# Altium project TEBF0808.PrjPCB (part 4 of 6)

## Sheet FMC.SchDoc: TEBF0808 - FMC
size A4; Organization: Trenz Electronic GmbH; DocumentNumber: TEBF0808; Revision: 04; SheetNumber: 18; SheetTotal: 36; Date: 2016-09-29; CompanyName: Trenz Electronic GmbH; ProjectName: TEB0808 - LAN9514
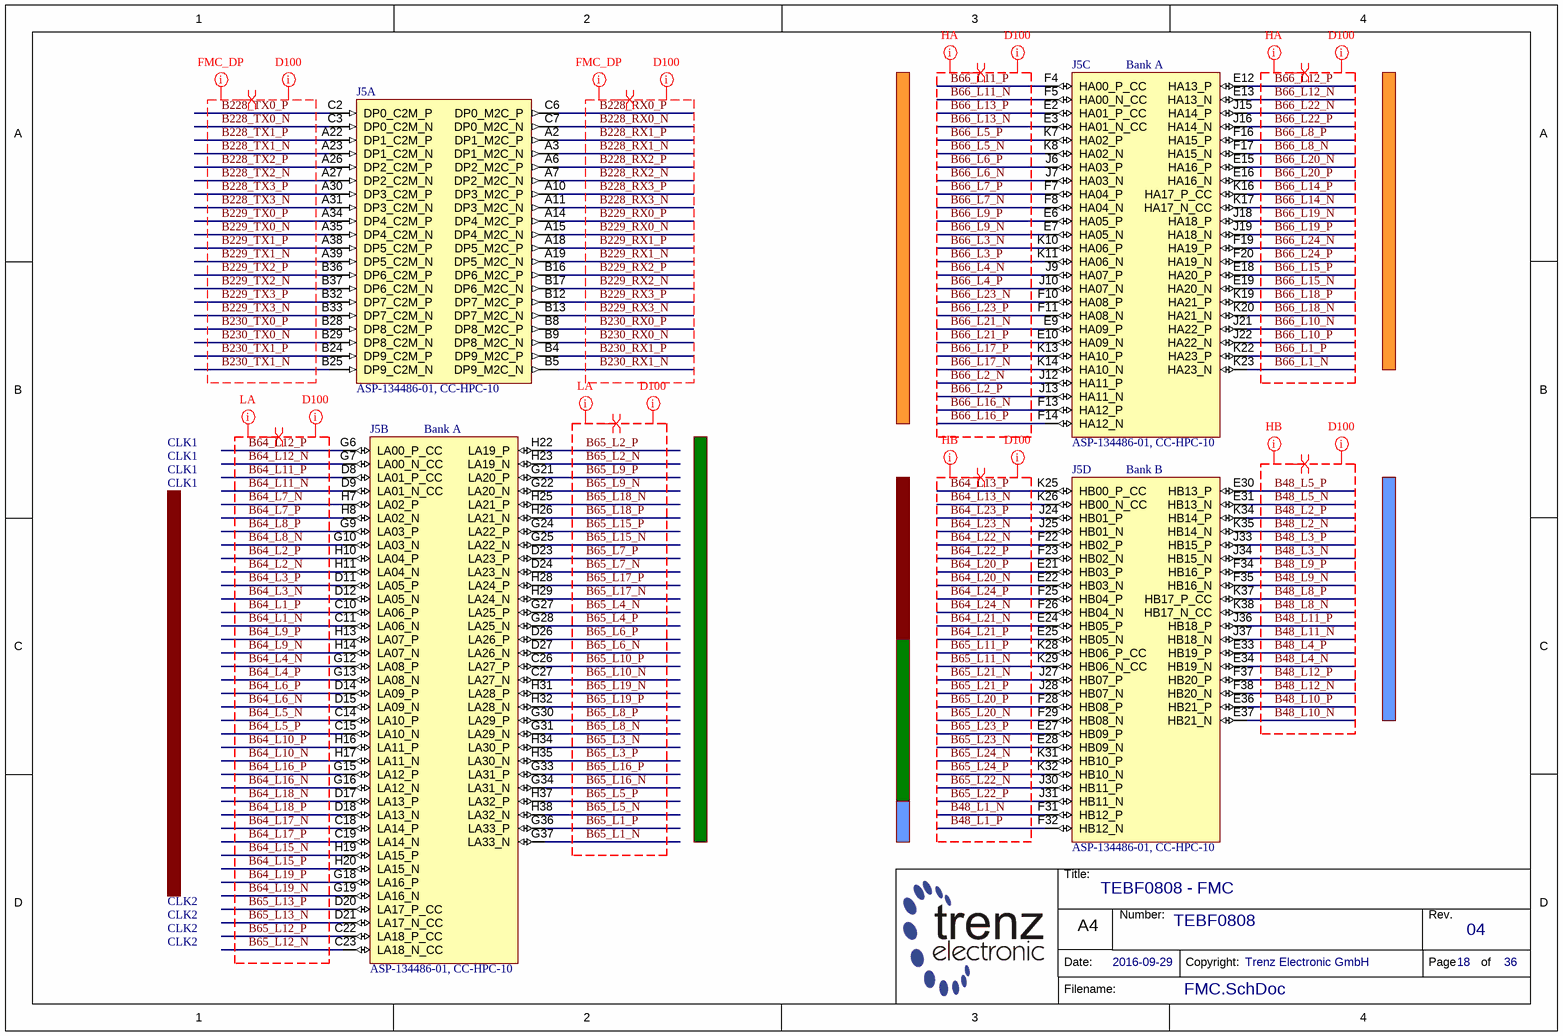
[diagram p22: FMC.SchDoc]

### Parts
J5  ASP-134486-01, CC-HPC-10  [ASP-134486-01B]  (parts A,B,C,D of 9)

### Nets
B48_L1_N: J5.F31(HB12_P)
B48_L1_P: J5.F32(HB12_N)
B48_L2_N: J5.K35(HB14_N)
B48_L2_P: J5.K34(HB14_P)
B48_L3_N: J5.J34(HB15_N)
B48_L3_P: J5.J33(HB15_P)
B48_L4_N: J5.E34(HB19_N)
B48_L4_P: J5.E33(HB19_P)
B48_L5_N: J5.E31(HB13_N)
B48_L5_P: J5.E30(HB13_P)
B48_L8_N: J5.K38(HB17_N_CC)
B48_L8_P: J5.K37(HB17_P_CC)
B48_L9_N: J5.F35(HB16_N)
B48_L9_P: J5.F34(HB16_P)
B48_L10_N: J5.E37(HB21_N)
B48_L10_P: J5.E36(HB21_P)
B48_L11_N: J5.J37(HB18_N)
B48_L11_P: J5.J36(HB18_P)
B48_L12_N: J5.F38(HB20_N)
B48_L12_P: J5.F37(HB20_P)
B64_L1_N: J5.C11(LA06_N)
B64_L1_P: J5.C10(LA06_P)
B64_L2_N: J5.H11(LA04_N)
B64_L2_P: J5.H10(LA04_P)
B64_L3_N: J5.D12(LA05_N)
B64_L3_P: J5.D11(LA05_P)
B64_L4_N: J5.G12(LA08_P)
B64_L4_P: J5.G13(LA08_N)
B64_L5_N: J5.C14(LA10_P)
B64_L5_P: J5.C15(LA10_N)
B64_L6_N: J5.D15(LA09_N)
B64_L6_P: J5.D14(LA09_P)
B64_L7_N: J5.H7(LA02_P)
B64_L7_P: J5.H8(LA02_N)
B64_L8_N: J5.G10(LA03_N)
B64_L8_P: J5.G9(LA03_P)
B64_L9_N: J5.H14(LA07_N)
B64_L9_P: J5.H13(LA07_P)
B64_L10_N: J5.H17(LA11_N)
B64_L10_P: J5.H16(LA11_P)
B64_L11_N: J5.D9(LA01_N_CC)
B64_L11_P: J5.D8(LA01_P_CC)
B64_L12_N: J5.G7(LA00_N_CC)
B64_L12_P: J5.G6(LA00_P_CC)
B64_L13_N: J5.K26(HB00_N_CC)
B64_L13_P: J5.K25(HB00_P_CC)
B64_L15_N: J5.H19(LA15_P)
B64_L15_P: J5.H20(LA15_N)
B64_L16_N: J5.G16(LA12_N)
B64_L16_P: J5.G15(LA12_P)
B64_L17_N: J5.C18(LA14_P)
B64_L17_P: J5.C19(LA14_N)
B64_L18_N: J5.D17(LA13_P)
B64_L18_P: J5.D18(LA13_N)
B64_L19_N: J5.G19(LA16_N)
B64_L19_P: J5.G18(LA16_P)
B64_L20_N: J5.E22(HB03_N)
B64_L20_P: J5.E21(HB03_P)
B64_L21_N: J5.E24(HB05_P)
B64_L21_P: J5.E25(HB05_N)
B64_L22_N: J5.F22(HB02_P)
B64_L22_P: J5.F23(HB02_N)
B64_L23_N: J5.J25(HB01_N)
B64_L23_P: J5.J24(HB01_P)
B64_L24_N: J5.F26(HB04_N)
B64_L24_P: J5.F25(HB04_P)
B65_L1_N: J5.G37(LA33_N)
B65_L1_P: J5.G36(LA33_P)
B65_L2_N: J5.H23(LA19_N)
B65_L2_P: J5.H22(LA19_P)
B65_L3_N: J5.H34(LA30_P)
B65_L3_P: J5.H35(LA30_N)
B65_L4_N: J5.G27(LA25_P)
B65_L4_P: J5.G28(LA25_N)
B65_L5_N: J5.H38(LA32_N)
B65_L5_P: J5.H37(LA32_P)
B65_L6_N: J5.D27(LA26_N)
B65_L6_P: J5.D26(LA26_P)
B65_L7_N: J5.D24(LA23_N)
B65_L7_P: J5.D23(LA23_P)
B65_L8_N: J5.G31(LA29_N)
B65_L8_P: J5.G30(LA29_P)
B65_L9_N: J5.G22(LA20_N)
B65_L9_P: J5.G21(LA20_P)
B65_L10_N: J5.C27(LA27_N)
B65_L10_P: J5.C26(LA27_P)
B65_L11_N: J5.K29(HB06_N_CC)
B65_L11_P: J5.K28(HB06_P_CC)
B65_L12_N: J5.C23(LA18_N_CC)
B65_L12_P: J5.C22(LA18_P_CC)
B65_L13_N: J5.D21(LA17_N_CC)
B65_L13_P: J5.D20(LA17_P_CC)
B65_L15_N: J5.G25(LA22_N)
B65_L15_P: J5.G24(LA22_P)
B65_L16_N: J5.G34(LA31_N)
B65_L16_P: J5.G33(LA31_P)
B65_L17_N: J5.H29(LA24_N)
B65_L17_P: J5.H28(LA24_P)
B65_L18_N: J5.H25(LA21_P)
B65_L18_P: J5.H26(LA21_N)
B65_L19_N: J5.H31(LA28_P)
B65_L19_P: J5.H32(LA28_N)
B65_L20_N: J5.F29(HB08_N)
B65_L20_P: J5.F28(HB08_P)
B65_L21_N: J5.J27(HB07_P)
B65_L21_P: J5.J28(HB07_N)
B65_L22_N: J5.J30(HB11_P)
B65_L22_P: J5.J31(HB11_N)
B65_L23_N: J5.E28(HB09_N)
B65_L23_P: J5.E27(HB09_P)
B65_L24_N: J5.K31(HB10_P)
B65_L24_P: J5.K32(HB10_N)
B66_L1_N: J5.K23(HA23_N)
B66_L1_P: J5.K22(HA23_P)
B66_L2_N: J5.J12(HA11_P)
B66_L2_P: J5.J13(HA11_N)
B66_L3_N: J5.K10(HA06_P)
B66_L3_P: J5.K11(HA06_N)
B66_L4_N: J5.J9(HA07_P)
B66_L4_P: J5.J10(HA07_N)
B66_L5_N: J5.K8(HA02_N)
B66_L5_P: J5.K7(HA02_P)
B66_L6_N: J5.J7(HA03_N)
B66_L6_P: J5.J6(HA03_P)
B66_L7_N: J5.F8(HA04_N)
B66_L7_P: J5.F7(HA04_P)
B66_L8_N: J5.F17(HA15_N)
B66_L8_P: J5.F16(HA15_P)
B66_L9_N: J5.E7(HA05_N)
B66_L9_P: J5.E6(HA05_P)
B66_L10_N: J5.J21(HA22_P)
B66_L10_P: J5.J22(HA22_N)
B66_L11_N: J5.F5(HA00_N_CC)
B66_L11_P: J5.F4(HA00_P_CC)
B66_L12_N: J5.E13(HA13_N)
B66_L12_P: J5.E12(HA13_P)
B66_L13_N: J5.E3(HA01_N_CC)
B66_L13_P: J5.E2(HA01_P_CC)
B66_L14_N: J5.K17(HA17_N_CC)
B66_L14_P: J5.K16(HA17_P_CC)
B66_L15_N: J5.E19(HA20_N)
B66_L15_P: J5.E18(HA20_P)
B66_L16_N: J5.F13(HA12_P)
B66_L16_P: J5.F14(HA12_N)
B66_L17_N: J5.K14(HA10_N)
B66_L17_P: J5.K13(HA10_P)
B66_L18_N: J5.K20(HA21_N)
B66_L18_P: J5.K19(HA21_P)
B66_L19_N: J5.J18(HA18_P)
B66_L19_P: J5.J19(HA18_N)
B66_L20_N: J5.E15(HA16_P)
B66_L20_P: J5.E16(HA16_N)
B66_L21_N: J5.E9(HA09_P)
B66_L21_P: J5.E10(HA09_N)
B66_L22_N: J5.J15(HA14_P)
B66_L22_P: J5.J16(HA14_N)
B66_L23_N: J5.F10(HA08_P)
B66_L23_P: J5.F11(HA08_N)
B66_L24_N: J5.F19(HA19_P)
B66_L24_P: J5.F20(HA19_N)
B228_RX0_N: J5.C7(DP0_M2C_N)
B228_RX0_P: J5.C6(DP0_M2C_P)
B228_RX1_N: J5.A3(DP1_M2C_N)
B228_RX1_P: J5.A2(DP1_M2C_P)
B228_RX2_N: J5.A7(DP2_M2C_N)
B228_RX2_P: J5.A6(DP2_M2C_P)
B228_RX3_N: J5.A11(DP3_M2C_N)
B228_RX3_P: J5.A10(DP3_M2C_P)
B228_TX0_N: J5.C3(DP0_C2M_N)
B228_TX0_P: J5.C2(DP0_C2M_P)
B228_TX1_N: J5.A23(DP1_C2M_N)
B228_TX1_P: J5.A22(DP1_C2M_P)
B228_TX2_N: J5.A27(DP2_C2M_N)
B228_TX2_P: J5.A26(DP2_C2M_P)
B228_TX3_N: J5.A31(DP3_C2M_N)
B228_TX3_P: J5.A30(DP3_C2M_P)
B229_RX0_N: J5.A15(DP4_M2C_N)
B229_RX0_P: J5.A14(DP4_M2C_P)
B229_RX1_N: J5.A19(DP5_M2C_N)
B229_RX1_P: J5.A18(DP5_M2C_P)
B229_RX2_N: J5.B17(DP6_M2C_N)
B229_RX2_P: J5.B16(DP6_M2C_P)
B229_RX3_N: J5.B13(DP7_M2C_N)
B229_RX3_P: J5.B12(DP7_M2C_P)
B229_TX0_N: J5.A35(DP4_C2M_N)
B229_TX0_P: J5.A34(DP4_C2M_P)
B229_TX1_N: J5.A39(DP5_C2M_N)
B229_TX1_P: J5.A38(DP5_C2M_P)
B229_TX2_N: J5.B37(DP6_C2M_N)
B229_TX2_P: J5.B36(DP6_C2M_P)
B229_TX3_N: J5.B33(DP7_C2M_N)
B229_TX3_P: J5.B32(DP7_C2M_P)
B230_RX0_N: J5.B9(DP8_M2C_N)
B230_RX0_P: J5.B8(DP8_M2C_P)
B230_RX1_N: J5.B5(DP9_M2C_N)
B230_RX1_P: J5.B4(DP9_M2C_P)
B230_TX0_N: J5.B29(DP8_C2M_N)
B230_TX0_P: J5.B28(DP8_C2M_P)
B230_TX1_N: J5.B25(DP9_C2M_N)
B230_TX1_P: J5.B24(DP9_C2M_P)

### Layout directives
differential pair: B48_L1_N, B48_L1_P, B48_L2_N, B48_L2_P, B48_L3_N, B48_L3_P, B48_L4_N, B48_L4_P, B48_L5_N, B48_L5_P, B48_L8_N, B48_L8_P, B48_L9_N, B48_L9_P, B48_L10_N, B48_L10_P, B48_L11_N, B48_L11_P, B48_L12_N, B48_L12_P, B64_L1_N, B64_L1_P, B64_L2_N, B64_L2_P, B64_L3_N, B64_L3_P, B64_L4_N, B64_L4_P, B64_L5_N, B64_L5_P, B64_L6_N, B64_L6_P, B64_L7_N, B64_L7_P, B64_L8_N, B64_L8_P, B64_L9_N, B64_L9_P, B64_L10_N, B64_L10_P, B64_L11_N, B64_L11_P, B64_L12_N, B64_L12_P, B64_L13_N, B64_L13_P, B64_L15_N, B64_L15_P, B64_L16_N, B64_L16_P, B64_L17_N, B64_L17_P, B64_L18_N, B64_L18_P, B64_L19_N, B64_L19_P, B64_L20_N, B64_L20_P, B64_L21_N, B64_L21_P, B64_L22_N, B64_L22_P, B64_L23_N, B64_L23_P, B64_L24_N, B64_L24_P, B65_L1_N, B65_L1_P, B65_L2_N, B65_L2_P, B65_L3_N, B65_L3_P, B65_L4_N, B65_L4_P, B65_L5_N, B65_L5_P, B65_L6_N, B65_L6_P, B65_L7_N, B65_L7_P, B65_L8_N, B65_L8_P, B65_L9_N, B65_L9_P, B65_L10_N, B65_L10_P, B65_L11_N, B65_L11_P, B65_L12_N, B65_L12_P, B65_L13_N, B65_L13_P, B65_L15_N, B65_L15_P, B65_L16_N, B65_L16_P, B65_L17_N, B65_L17_P, B65_L18_N, B65_L18_P, B65_L19_N, B65_L19_P, B65_L20_N, B65_L20_P, B65_L21_N, B65_L21_P, B65_L22_N, B65_L22_P, B65_L23_N, B65_L23_P, B65_L24_N, B65_L24_P, B66_L1_N, B66_L1_P, B66_L2_N, B66_L2_P, B66_L3_N, B66_L3_P, B66_L4_N, B66_L4_P, B66_L5_N, B66_L5_P, B66_L6_N, B66_L6_P, B66_L7_N, B66_L7_P, B66_L8_N, B66_L8_P, B66_L9_N, B66_L9_P, B66_L10_N, B66_L10_P, B66_L11_N, B66_L11_P, B66_L12_N, B66_L12_P, B66_L13_N, B66_L13_P, B66_L14_N, B66_L14_P, B66_L15_N, B66_L15_P, B66_L16_N, B66_L16_P, B66_L17_N, B66_L17_P, B66_L18_N, B66_L18_P, B66_L19_N, B66_L19_P, B66_L20_N, B66_L20_P, B66_L21_N, B66_L21_P, B66_L22_N, B66_L22_P, B66_L23_N, B66_L23_P, B66_L24_N, B66_L24_P, B228_RX0_N, B228_RX0_P, B228_RX1_N, B228_RX1_P, B228_RX2_N, B228_RX2_P, B228_RX3_N, B228_RX3_P, B228_TX0_N, B228_TX0_P, B228_TX1_N, B228_TX1_P, B228_TX2_N, B228_TX2_P, B228_TX3_N, B228_TX3_P, B229_RX0_N, B229_RX0_P, B229_RX1_N, B229_RX1_P, B229_RX2_N, B229_RX2_P, B229_RX3_N, B229_RX3_P, B229_TX0_N, B229_TX0_P, B229_TX1_N, B229_TX1_P, B229_TX2_N, B229_TX2_P, B229_TX3_N, B229_TX3_P, B230_RX0_N, B230_RX0_P, B230_RX1_N, B230_RX1_P, B230_TX0_N, B230_TX0_P, B230_TX1_N, B230_TX1_P
net class FMC_DP: B228_RX0_N, B228_RX0_P, B228_RX1_N, B228_RX1_P, B228_RX2_N, B228_RX2_P, B228_RX3_N, B228_RX3_P, B228_TX0_N, B228_TX0_P, B228_TX1_N, B228_TX1_P, B228_TX2_N, B228_TX2_P, B228_TX3_N, B228_TX3_P, B229_RX0_N, B229_RX0_P, B229_RX1_N, B229_RX1_P, B229_RX2_N, B229_RX2_P, B229_RX3_N, B229_RX3_P, B229_TX0_N, B229_TX0_P, B229_TX1_N, B229_TX1_P, B229_TX2_N, B229_TX2_P, B229_TX3_N, B229_TX3_P, B230_RX0_N, B230_RX0_P, B230_RX1_N, B230_RX1_P, B230_TX0_N, B230_TX0_P, B230_TX1_N, B230_TX1_P
net class LA: B64_L1_N, B64_L1_P, B64_L2_N, B64_L2_P, B64_L3_N, B64_L3_P, B64_L4_N, B64_L4_P, B64_L5_N, B64_L5_P, B64_L6_N, B64_L6_P, B64_L7_N, B64_L7_P, B64_L8_N, B64_L8_P, B64_L9_N, B64_L9_P, B64_L10_N, B64_L10_P, B64_L11_N, B64_L11_P, B64_L12_N, B64_L12_P, B64_L15_N, B64_L15_P, B64_L16_N, B64_L16_P, B64_L17_N, B64_L17_P, B64_L18_N, B64_L18_P, B64_L19_N, B64_L19_P, B65_L1_N, B65_L1_P, B65_L2_N, B65_L2_P, B65_L3_N, B65_L3_P, B65_L4_N, B65_L4_P, B65_L5_N, B65_L5_P, B65_L6_N, B65_L6_P, B65_L7_N, B65_L7_P, B65_L8_N, B65_L8_P, B65_L9_N, B65_L9_P, B65_L10_N, B65_L10_P, B65_L12_N, B65_L12_P, B65_L13_N, B65_L13_P, B65_L15_N, B65_L15_P, B65_L16_N, B65_L16_P, B65_L17_N, B65_L17_P, B65_L18_N, B65_L18_P, B65_L19_N, B65_L19_P
net class D100: B48_L1_N, B48_L1_P, B48_L2_N, B48_L2_P, B48_L3_N, B48_L3_P, B48_L4_N, B48_L4_P, B48_L5_N, B48_L5_P, B48_L8_N, B48_L8_P, B48_L9_N, B48_L9_P, B48_L10_N, B48_L10_P, B48_L11_N, B48_L11_P, B48_L12_N, B48_L12_P, B64_L1_N, B64_L1_P, B64_L2_N, B64_L2_P, B64_L3_N, B64_L3_P, B64_L4_N, B64_L4_P, B64_L5_N, B64_L5_P, B64_L6_N, B64_L6_P, B64_L7_N, B64_L7_P, B64_L8_N, B64_L8_P, B64_L9_N, B64_L9_P, B64_L10_N, B64_L10_P, B64_L11_N, B64_L11_P, B64_L12_N, B64_L12_P, B64_L13_N, B64_L13_P, B64_L15_N, B64_L15_P, B64_L16_N, B64_L16_P, B64_L17_N, B64_L17_P, B64_L18_N, B64_L18_P, B64_L19_N, B64_L19_P, B64_L20_N, B64_L20_P, B64_L21_N, B64_L21_P, B64_L22_N, B64_L22_P, B64_L23_N, B64_L23_P, B64_L24_N, B64_L24_P, B65_L1_N, B65_L1_P, B65_L2_N, B65_L2_P, B65_L3_N, B65_L3_P, B65_L4_N, B65_L4_P, B65_L5_N, B65_L5_P, B65_L6_N, B65_L6_P, B65_L7_N, B65_L7_P, B65_L8_N, B65_L8_P, B65_L9_N, B65_L9_P, B65_L10_N, B65_L10_P, B65_L11_N, B65_L11_P, B65_L12_N, B65_L12_P, B65_L13_N, B65_L13_P, B65_L15_N, B65_L15_P, B65_L16_N, B65_L16_P, B65_L17_N, B65_L17_P, B65_L18_N, B65_L18_P, B65_L19_N, B65_L19_P, B65_L20_N, B65_L20_P, B65_L21_N, B65_L21_P, B65_L22_N, B65_L22_P, B65_L23_N, B65_L23_P, B65_L24_N, B65_L24_P, B66_L1_N, B66_L1_P, B66_L2_N, B66_L2_P, B66_L3_N, B66_L3_P, B66_L4_N, B66_L4_P, B66_L5_N, B66_L5_P, B66_L6_N, B66_L6_P, B66_L7_N, B66_L7_P, B66_L8_N, B66_L8_P, B66_L9_N, B66_L9_P, B66_L10_N, B66_L10_P, B66_L11_N, B66_L11_P, B66_L12_N, B66_L12_P, B66_L13_N, B66_L13_P, B66_L14_N, B66_L14_P, B66_L15_N, B66_L15_P, B66_L16_N, B66_L16_P, B66_L17_N, B66_L17_P, B66_L18_N, B66_L18_P, B66_L19_N, B66_L19_P, B66_L20_N, B66_L20_P, B66_L21_N, B66_L21_P, B66_L22_N, B66_L22_P, B66_L23_N, B66_L23_P, B66_L24_N, B66_L24_P, B228_RX0_N, B228_RX0_P, B228_RX1_N, B228_RX1_P, B228_RX2_N, B228_RX2_P, B228_RX3_N, B228_RX3_P, B228_TX0_N, B228_TX0_P, B228_TX1_N, B228_TX1_P, B228_TX2_N, B228_TX2_P, B228_TX3_N, B228_TX3_P, B229_RX0_N, B229_RX0_P, B229_RX1_N, B229_RX1_P, B229_RX2_N, B229_RX2_P, B229_RX3_N, B229_RX3_P, B229_TX0_N, B229_TX0_P, B229_TX1_N, B229_TX1_P, B229_TX2_N, B229_TX2_P, B229_TX3_N, B229_TX3_P, B230_RX0_N, B230_RX0_P, B230_RX1_N, B230_RX1_P, B230_TX0_N, B230_TX0_P, B230_TX1_N, B230_TX1_P
net class HA: B66_L1_N, B66_L1_P, B66_L2_N, B66_L2_P, B66_L3_N, B66_L3_P, B66_L4_N, B66_L4_P, B66_L5_N, B66_L5_P, B66_L6_N, B66_L6_P, B66_L7_N, B66_L7_P, B66_L8_N, B66_L8_P, B66_L9_N, B66_L9_P, B66_L10_N, B66_L10_P, B66_L11_N, B66_L11_P, B66_L12_N, B66_L12_P, B66_L13_N, B66_L13_P, B66_L14_N, B66_L14_P, B66_L15_N, B66_L15_P, B66_L16_N, B66_L16_P, B66_L17_N, B66_L17_P, B66_L18_N, B66_L18_P, B66_L19_N, B66_L19_P, B66_L20_N, B66_L20_P, B66_L21_N, B66_L21_P, B66_L22_N, B66_L22_P, B66_L23_N, B66_L23_P, B66_L24_N, B66_L24_P
net class HB: B48_L1_N, B48_L1_P, B48_L2_N, B48_L2_P, B48_L3_N, B48_L3_P, B48_L4_N, B48_L4_P, B48_L5_N, B48_L5_P, B48_L8_N, B48_L8_P, B48_L9_N, B48_L9_P, B48_L10_N, B48_L10_P, B48_L11_N, B48_L11_P, B48_L12_N, B48_L12_P, B64_L13_N, B64_L13_P, B64_L20_N, B64_L20_P, B64_L21_N, B64_L21_P, B64_L22_N, B64_L22_P, B64_L23_N, B64_L23_P, B64_L24_N, B64_L24_P, B65_L11_N, B65_L11_P, B65_L20_N, B65_L20_P, B65_L21_N, B65_L21_P, B65_L22_N, B65_L22_P, B65_L23_N, B65_L23_P, B65_L24_N, B65_L24_P

### Notes on the sheet
- (near J5) Bank A
- CLK1
- (near J5) Bank B
- CLK2
- Title:
- Number:
- Rev.
- Date:
- A4
- Copyright:
- Page
- of
- Filename:

### Library data of the parts
J5 = 24851: ASP-134486-01 female, CC-HPC-10; AN: 24851; Mixed: SMT; Trenz-Stock: Yes; HelpURL: B:\AD\adlib\datasheet\Samtec; H-ART: ASP-134486-01

## Sheet FMC PWR.SchDoc: TEBF0808 - FMC
size A4; Organization: Trenz Electronic GmbH; DocumentNumber: TEBF0808; Revision: 04; SheetNumber: 17; SheetTotal: 36; Date: 2016-09-29; CompanyName: Trenz Electronic GmbH; ProjectName: TEB0808 - LAN9514
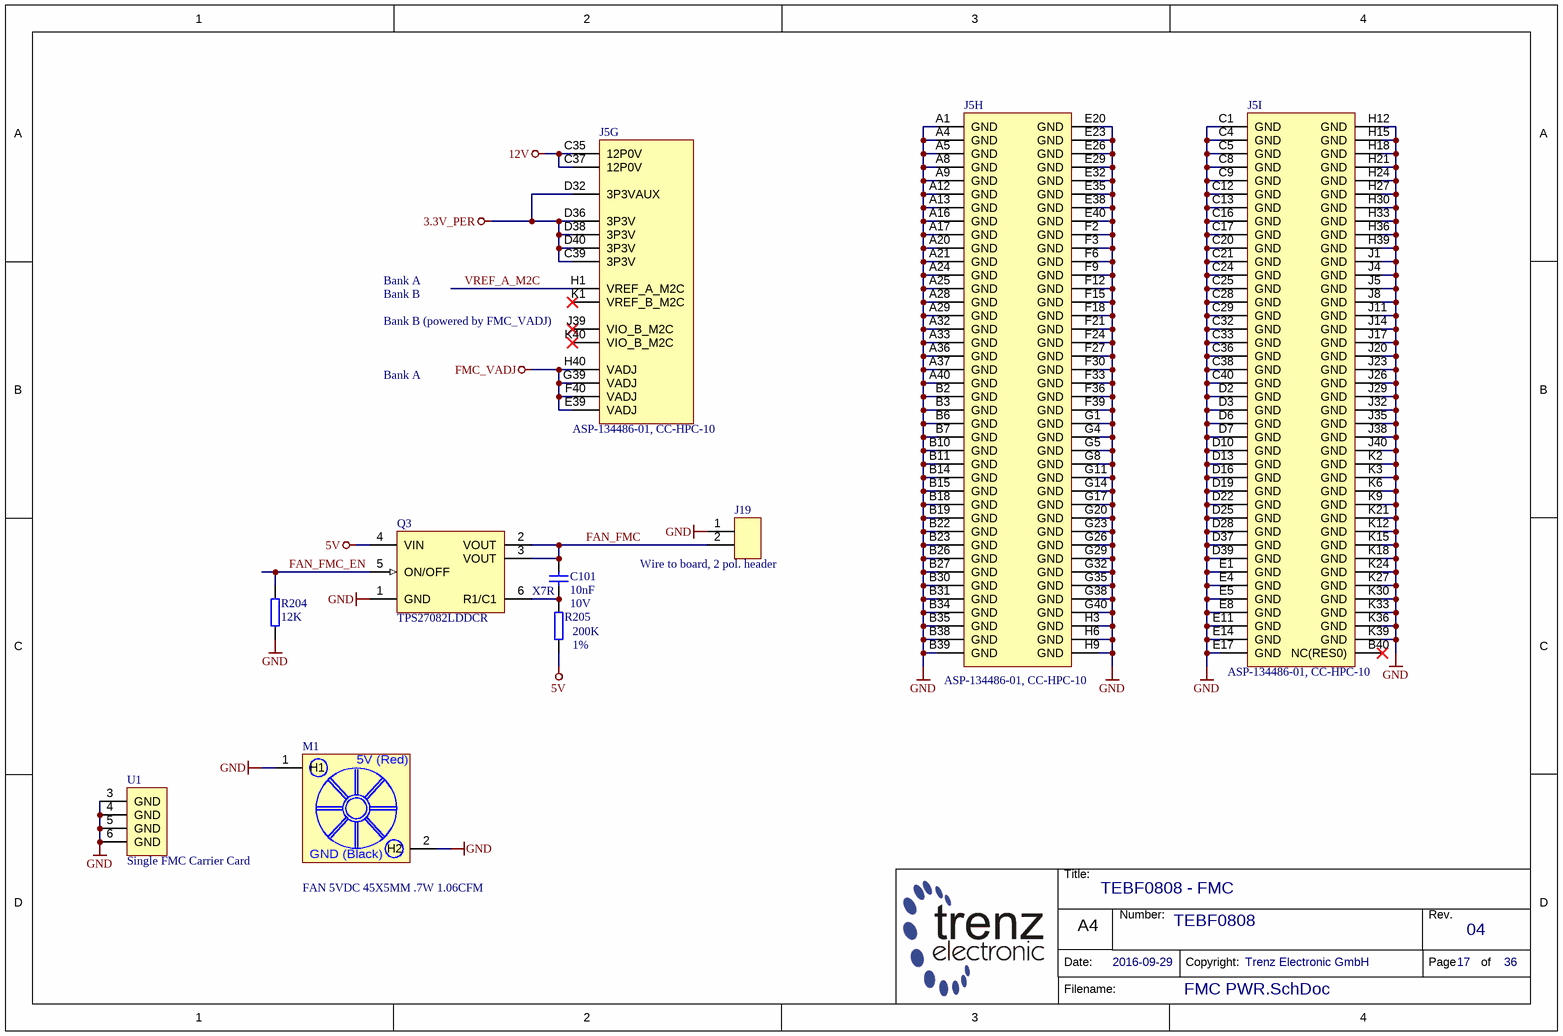
[diagram p23: FMC PWR.SchDoc]

### Parts
C101  10nF  Voltage: 10V  Technology: X7R  [CAPC0603X33N]
J5  ASP-134486-01, CC-HPC-10  [ASP-134486-01B]  (parts G,H,I of 9)
J19  Wire to board, 2 pol. header  [Molex22-27-2021]
M1  FAN 5VDC 45X5MM .7W 1.06CFM  [F455B-05MD]
Q3  TPS27082LDDCR  [SOT95P280X110-6N]
R204  12K  [RESC1005X40N]
R205  200K  Tolerance: 1%  [RESC1005X40N]
U1  Single FMC Carrier Card  [FMC-MM-Single-Base]

### Nets
3.3V_PER: J5.C39(3P3V) J5.D32(3P3VAUX) J5.D36(3P3V) J5.D38(3P3V) J5.D40(3P3V)
5V: Q3.4(VIN) R205.2
12V: J5.C35(12P0V) J5.C37(12P0V)
FMC_VADJ: J5.E39(VADJ) J5.F40(VADJ) J5.G39(VADJ) J5.H40(VADJ)
GND: J5.A1(GND) J5.A4(GND) J5.A5(GND) J5.A8(GND) J5.A9(GND) J5.A12(GND) J5.A13(GND) J5.A16(GND) J5.A17(GND) J5.A20(GND) J5.A21(GND) J5.A24(GND) J5.A25(GND) J5.A28(GND) J5.A29(GND) J5.A32(GND) J5.A33(GND) J5.A36(GND) J5.A37(GND) J5.A40(GND) J5.B2(GND) J5.B3(GND) J5.B6(GND) J5.B7(GND) J5.B10(GND) J5.B11(GND) J5.B14(GND) J5.B15(GND) J5.B18(GND) J5.B19(GND) J5.B22(GND) J5.B23(GND) J5.B26(GND) J5.B27(GND) J5.B30(GND) J5.B31(GND) J5.B34(GND) J5.B35(GND) J5.B38(GND) J5.B39(GND) J5.C1(GND) J5.C4(GND) J5.C5(GND) J5.C8(GND) J5.C9(GND) J5.C12(GND) J5.C13(GND) J5.C16(GND) J5.C17(GND) J5.C20(GND) J5.C21(GND) J5.C24(GND) J5.C25(GND) J5.C28(GND) J5.C29(GND) J5.C32(GND) J5.C33(GND) J5.C36(GND) J5.C38(GND) J5.C40(GND) J5.D2(GND) J5.D3(GND) J5.D6(GND) J5.D7(GND) J5.D10(GND) J5.D13(GND) J5.D16(GND) J5.D19(GND) J5.D22(GND) J5.D25(GND) J5.D28(GND) J5.D37(GND) J5.D39(GND) J5.E1(GND) J5.E4(GND) J5.E5(GND) J5.E8(GND) J5.E11(GND) J5.E14(GND) J5.E17(GND) J5.E20(GND) J5.E23(GND) J5.E26(GND) J5.E29(GND) J5.E32(GND) J5.E35(GND) J5.E38(GND) J5.E40(GND) J5.F2(GND) J5.F3(GND) J5.F6(GND) J5.F9(GND) J5.F12(GND) J5.F15(GND) J5.F18(GND) J5.F21(GND) J5.F24(GND) J5.F27(GND) J5.F30(GND) J5.F33(GND) J5.F36(GND) J5.F39(GND) J5.G1(GND) J5.G4(GND) J5.G5(GND) J5.G8(GND) J5.G11(GND) J5.G14(GND) J5.G17(GND) J5.G20(GND) J5.G23(GND) J5.G26(GND) J5.G29(GND) J5.G32(GND) J5.G35(GND) J5.G38(GND) J5.G40(GND) J5.H3(GND) J5.H6(GND) J5.H9(GND) J5.H12(GND) J5.H15(GND) J5.H18(GND) J5.H21(GND) J5.H24(GND) J5.H27(GND) J5.H30(GND) J5.H33(GND) J5.H36(GND) J5.H39(GND) J5.J1(GND) J5.J4(GND) J5.J5(GND) J5.J8(GND) J5.J11(GND) J5.J14(GND) J5.J17(GND) J5.J20(GND) J5.J23(GND) J5.J26(GND) J5.J29(GND) J5.J32(GND) J5.J35(GND) J5.J38(GND) J5.J40(GND) J5.K2(GND) J5.K3(GND) J5.K6(GND) J5.K9(GND) J5.K12(GND) J5.K15(GND) J5.K18(GND) J5.K21(GND) J5.K24(GND) J5.K27(GND) J5.K30(GND) J5.K33(GND) J5.K36(GND) J5.K39(GND) J19.1 M1.1(H1) M1.2(H2) Q3.1(GND) R204.2 U1.3(GND) U1.4(GND) U1.5(GND) U1.6(GND)
FAN_FMC: C101.1 J19.2 Q3.2(VOUT) Q3.3(VOUT)
FAN_FMC_EN: Q3.5(ON/OFF) R204.1
VREF_A_M2C: J5.H1(VREF_A_M2C)
NetC101_2: C101.2 Q3.6(R1/C1) R205.1

Not connected (* = marked no-connect by the designer): J5 B40(NC(RES0))* J39(VIO_B_M2C)* K1(VREF_B_M2C)* K40(VIO_B_M2C)*

### Notes on the sheet
- Bank A
- Bank B
- (near J5) Bank B (powered by FMC_VADJ)
- Title:
- Number:
- Rev.
- Date:
- A4
- Copyright:
- Page
- of
- Filename:
- (in symbol 25328) 5V (Red); GND (Black)

### Library data of the parts
C101 = 26312: KON 10nF X7R 10V SMD 10%; AN: 26312; Value: 10n; Mixed: SMT; Preferred: Yes; Case: 0603 (0201); Tolerance: 10%
J5 = 24851: as J5 on sheet FMC; HelpURL: B:\AD\adlib\datasheet\Samtec; H-ART: ASP-134486-01
J19 = 25507: Wire to board, 2 pol. header 0°; AN: 25507; Mixed: THT; HelpURL: B:\AD\adlib\datasheet\AE6410; H-ART: 22-27-2021
M1 = 25328: AN: 25328; Trenz-Stock: Yes; Mixed: MECH; HelpURL: B:\AD\adlib\datasheet\F455B; H-ART: F455B-05MD
Q3 = 25004: AN: 25004; Trenz-Stock: Yes; Mixed: SMT; Case: SOT23-6; HelpURL: B:\AD\adlib\datasheet\TPS27082L; Preferred: Yes; H-ART: TPS27082LDDCR
R204 = 22598: WID SMD 12K 1% 0,063W; AN: 22598; Mixed: SMT; Preferred: Yes; Tolerance: 1%; Case: 1005 (0402); Technology: TK100; Value: 12K
R205 = 23846: WID SMD 200K 1% 0,063W; AN: 23846; Mixed: SMT; Preferred: Yes; Case: 1005 (0402); Value: 200K; Technology: TK100
U1 = 25453: FMC-MM-Single PCB Baseboard Snap; AN: 25453; Mixed: MECH; Case: Single; HelpURL: B:\AD\adlib\datasheet\FMC Mezzanine Module

## Sheet Audio.SchDoc: TEBF0808 - Audio
size A4; Organization: Trenz Electronic GmbH; DocumentNumber: TEBF0808; Revision: 04; SheetNumber: 12; SheetTotal: 36; Date: 2016-09-29; CompanyName: Trenz Electronic GmbH
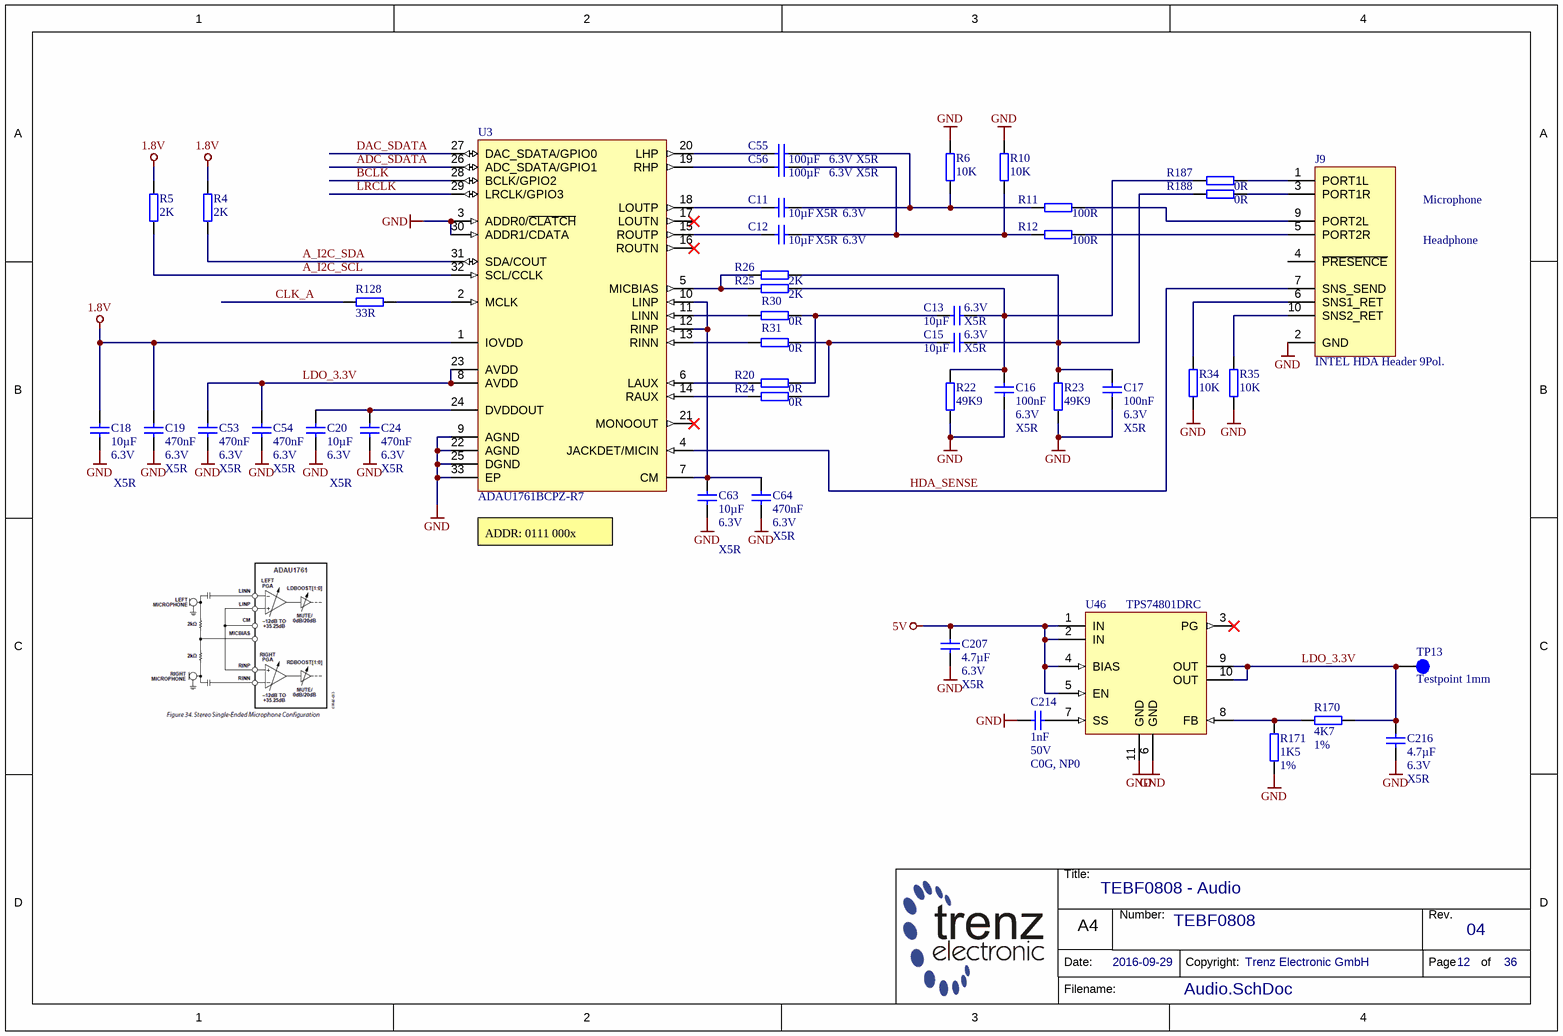
[diagram p24: Audio.SchDoc]

### Parts
C11  10µF  Voltage: 6.3V  Technology: X5R  [CAPC1608X90N]
C12  10µF  Voltage: 6.3V  Technology: X5R  [CAPC1608X90N]
C13  10µF  Voltage: 6.3V  Technology: X5R  [CAPC1608X90N]
C15  10µF  Voltage: 6.3V  Technology: X5R  [CAPC1608X90N]
C16  100nF  Voltage: 6.3V  Technology: X5R  [CAPC0603X33N]
C17  100nF  Voltage: 6.3V  Technology: X5R  [CAPC0603X33N]
C18  10µF  Voltage: 6.3V  Technology: X5R  [CAPC1608X90N]
C19  470nF  Voltage: 6.3V  Technology: X5R  [CAPC1005X55N]
C20  10µF  Voltage: 6.3V  Technology: X5R  [CAPC1608X90N]
C24  470nF  Voltage: 6.3V  Technology: X5R  [CAPC1005X55N]
C53  470nF  Voltage: 6.3V  Technology: X5R  [CAPC1005X55N]
C54  470nF  Voltage: 6.3V  Technology: X5R  [CAPC1005X55N]
C55  100µF  Voltage: 6.3V  Technology: X5R  [CAPC3216X180N]
C56  100µF  Voltage: 6.3V  Technology: X5R  [CAPC3216X180N]
C63  10µF  Voltage: 6.3V  Technology: X5R  [CAPC1608X90N]
C64  470nF  Voltage: 6.3V  Technology: X5R  [CAPC1005X55N]
C207  4.7µF  Voltage: 6.3V  Technology: X5R  [CAPC1005X60N]
C214  1nF  Voltage: 50V  Technology: C0G, NP0  [CAPC1005X55N]
C216  4.7µF  Voltage: 6.3V  Technology: X5R  [CAPC1005X60N]
J9  INTEL HDA Header 9Pol.  [INTEL_FP_HDA_9PIN]
R4  2K  [RESC1005X40N]
R5  2K  [RESC1005X40N]
R6  10K  [RESC1005X40N]
R10  10K  [RESC1005X40N]
R11  100R  [RESC1005X40N]
R12  100R  [RESC1005X40N]
R20  0R  [RESC1005X40N]
R22  49K9  [RESC1005X40N]
R23  49K9  [RESC1005X40N]
R24  0R  [RESC1005X40N]
R25  2K  [RESC1005X40N]
R26  2K  [RESC1005X40N]
R30  0R  [RESC1005X40N]
R31  0R  [RESC1005X40N]
R34  10K  [RESC1005X40N]
R35  10K  [RESC1005X40N]
R128  33R  [RESC1005X40N]
R170  4K7  Tolerance: 1%  [RESC1005X40N]
R171  1K5  Tolerance: 1%  [RESC1005X40N]
R187  0R  [RESC1005X40N]
R188  0R  [RESC1005X40N]
TP13  Testpoint 1mm  [TP_1mm]
U3  ADAU1761BCPZ-R7  [QFN50P500X500X100-33N]
U46  TPS74801DRC  [SON50P300X300X100-11N-TI]

### Nets
1.8V: C18.1 C19.1 R4.2 R5.2 U3.1(IOVDD)
5V: C207.1 U46.1(IN) U46.2(IN) U46.4(BIAS) U46.5(EN)
GND: C16.1 C17.1 C18.2 C19.2 C20.2 C24.2 C53.2 C54.2 C63.2 C64.2 C207.2 C214.1 C216.2 J9.2(GND) R6.1 R10.1 R22.2 R23.2 R34.1 R35.1 R171.2 U3.3(ADDR0/~{CLATCH}) U3.9(AGND) U3.22(AGND) U3.25(DGND) U3.30(ADDR1/CDATA) U3.33(EP) U46.6(GND) U46.11(GND)
A_I2C_SCL: R5.1 U3.32(SCL/CCLK)
A_I2C_SDA: R4.1 U3.31(SDA/COUT)
ADC_SDATA: U3.26(ADC_SDATA/GPIO1)
BCLK: U3.28(BCLK/GPIO2)
CLK_A: R128.1
DAC_SDATA: U3.27(DAC_SDATA/GPIO0)
HDA_SENSE: J9.7(SNS_SEND) U3.4(JACKDET/MICIN)
LDO_3.3V: C53.1 C54.1 C216.1 R170.2 TP13.1 U3.8(AVDD) U3.23(AVDD) U46.9(OUT) U46.10(OUT)
LRCLK: U3.29(LRCLK/GPIO3)
NetC11_1: C11.1 U3.18(LOUTP)
NetC11_2: C11.2 C55.2 R6.2 R11.1
NetC12_1: C12.1 U3.15(ROUTP)
NetC12_2: C12.2 C56.2 R10.2 R12.1
NetC13_1: C13.1 R20.1 R30.1
NetC13_2: C13.2 C16.2 R22.1 R25.2 R187.2
NetC15_1: C15.1 R24.1 R31.1
NetC15_2: C15.2 C17.2 R23.1 R26.2 R188.2
NetC20_1: C20.1 C24.1 U3.24(DVDDOUT)
NetC55_1: C55.1 U3.20(LHP)
NetC56_1: C56.1 U3.19(RHP)
NetC63_1: C63.1 C64.1 U3.7(CM) U3.10(LINP) U3.12(RINP)
NetC214_2: C214.2 U46.7(SS)
NetJ9_1: J9.1(PORT1L) R187.1
NetJ9_3: J9.3(PORT1R) R188.1
NetJ9_5: J9.5(PORT2R) R12.2
NetJ9_6: J9.6(SNS1_RET) R34.2
NetJ9_9: J9.9(PORT2L) R11.2
NetJ9_10: J9.10(SNS2_RET) R35.2
NetR20_2: R20.2 U3.6(LAUX)
NetR24_2: R24.2 U3.14(RAUX)
NetR25_1: R25.1 R26.1 U3.5(MICBIAS)
NetR30_2: R30.2 U3.11(LINN)
NetR31_2: R31.2 U3.13(RINN)
NetR128_2: R128.2 U3.2(MCLK)
NetR170_1: R170.1 R171.1 U46.8(FB)

Not connected (* = marked no-connect by the designer): J9 4(~{PRESENCE}); U3 16(ROUTN)* 17(LOUTN)* 21(MONOOUT)*; U46 3(PG)*

### Notes on the sheet
- Microphone
- Headphone
- (near U3) ADDR: 0111 000x
- Title:
- Number:
- Rev.
- Date:
- A4
- Copyright:
- Page
- of
- Filename:

### Library data of the parts
C11-C13 C15 C18 C20 C63 = 22918: KON 10µF 6,3V X5R SMD; AN: 22918; Mixed: SMT; Value: 10u; Case: 1608 (0603)
C16 C17 = 24915: KON 100nF 6.3V X5R SMD 10%; AN: 24915; Mixed: SMT; Value: 100n; Preferred: Yes; Case: 0603 (0201); Tolerance: 10%
C19 C24 C53 C54 C64 = 23659: KON 470nF 6,3V X5R SMD; AN: 23659; Value: 470n; Mixed: SMT; Preferred: Yes; Case: 1005 (0402)
C55 C56 = 23116: KON 100µF 6,3V X5R SMD 20%; AN: 23116; Mixed: SMT; Value: 100u; Preferred: Yes; Case: 3216 (1206); Tolerance: 20%
C207 C216 = 24719: KON 4.7µF 6.3V X5R SMD 20%; AN: 24719; Mixed: SMT; Value: 4.7u; Preferred: Yes; Case: 1005 (0402); Tolerance: 20%
C214 = 23752: KON 1nF NP0 SMD 5%; AN: 23752; Mixed: SMT; Value: 1n; Case: 1005 (0402); Tolerance: 5%
J9 = 27249: Stiftleiste Intel HDA Header 9polig; AN: 27249; Mixed: THT; Trenz-Stock: Yes; HelpURL: B:\AD\adlib\datasheet\INTEL_FP_CON
R4 R5 R25 R26 = 25073: WID SMD 2K 1% 0,063W; AN: 25073; Mixed: SMT; Tolerance: 1%; Case: 1005 (0402); Technology: TK100; Value: 2K
R6 R10 R34 R35 = 22750: WID SMD 10K 1% 0,063W; AN: 22750; Mixed: SMT; Preferred: Yes; Tolerance: 1%; Case: 1005 (0402); Technology: TK100; Value: 10K
R11 R12 = 22507: WID SMD 100R 1% 0,063W; AN: 22507; Mixed: SMT; Value: 100; Preferred: Yes; Tolerance: 1%; Case: 1005 (0402); Technology: TK100
R20 R24 R30 R31 R187 R188 = 22738: WID SMD 0R; AN: 22738; Tolerance: 1%; Mixed: SMT; Value: 0; Preferred: Yes; Case: 1005 (0402); Technology: TK100
R22 R23 = 24677: WID SMD 49K9 1% 0,063W; AN: 24677; Mixed: SMT; Value: 49.9K; Preferred: Yes; Tolerance: 1%; Case: 1005 (0402); Technology: TK100
R128 = 22770: WID SMD 33R 1% 0,063W; AN: 22770; Mixed: SMT; Value: 33; Preferred: Yes; Tolerance: 1%; Case: 1005 (0402); Technology: TK100
R170 = 22585: WID SMD 4K7 1% 0,063W; AN: 22585; Mixed: SMT; Value: 4.7K; Preferred: Yes; Case: 1005 (0402); Technology: TK100
R171 = 22602: WID SMD 1K5 1% 0,063W; AN: 22602; Mixed: SMT; Value: 1.5K; Preferred: Yes; Case: 1005 (0402); Technology: TK100
TP13 = 25063: AN: 25063; Mixed: SMT
U3 = 27279: AN: 27279; Mixed: SMT; Trenz-Stock: Yes; Case: LFCSP32; HelpURL: B:\\AD\adlib\datasheet\ADAU1761; H-ART: ADAU1761BCPZ-R7
U46 = 25235: AN: 25235; Mixed: SMT; Trenz-Stock: Yes; Case: DRC (S-PVSON-N10); HelpURL: B:\AD\adlib\datasheet\TPS74801; H-ART: TPS74801DRC

## Sheet MISC.schdoc: TEBF0808 - MISC
size A4; DocumentNumber: TEBF0808; Revision: 04; SheetNumber: 8; SheetTotal: 36; Date: 2016-09-29; CompanyName: Trenz Electronic GmbH; Organization: Trenz Electronic GmbH
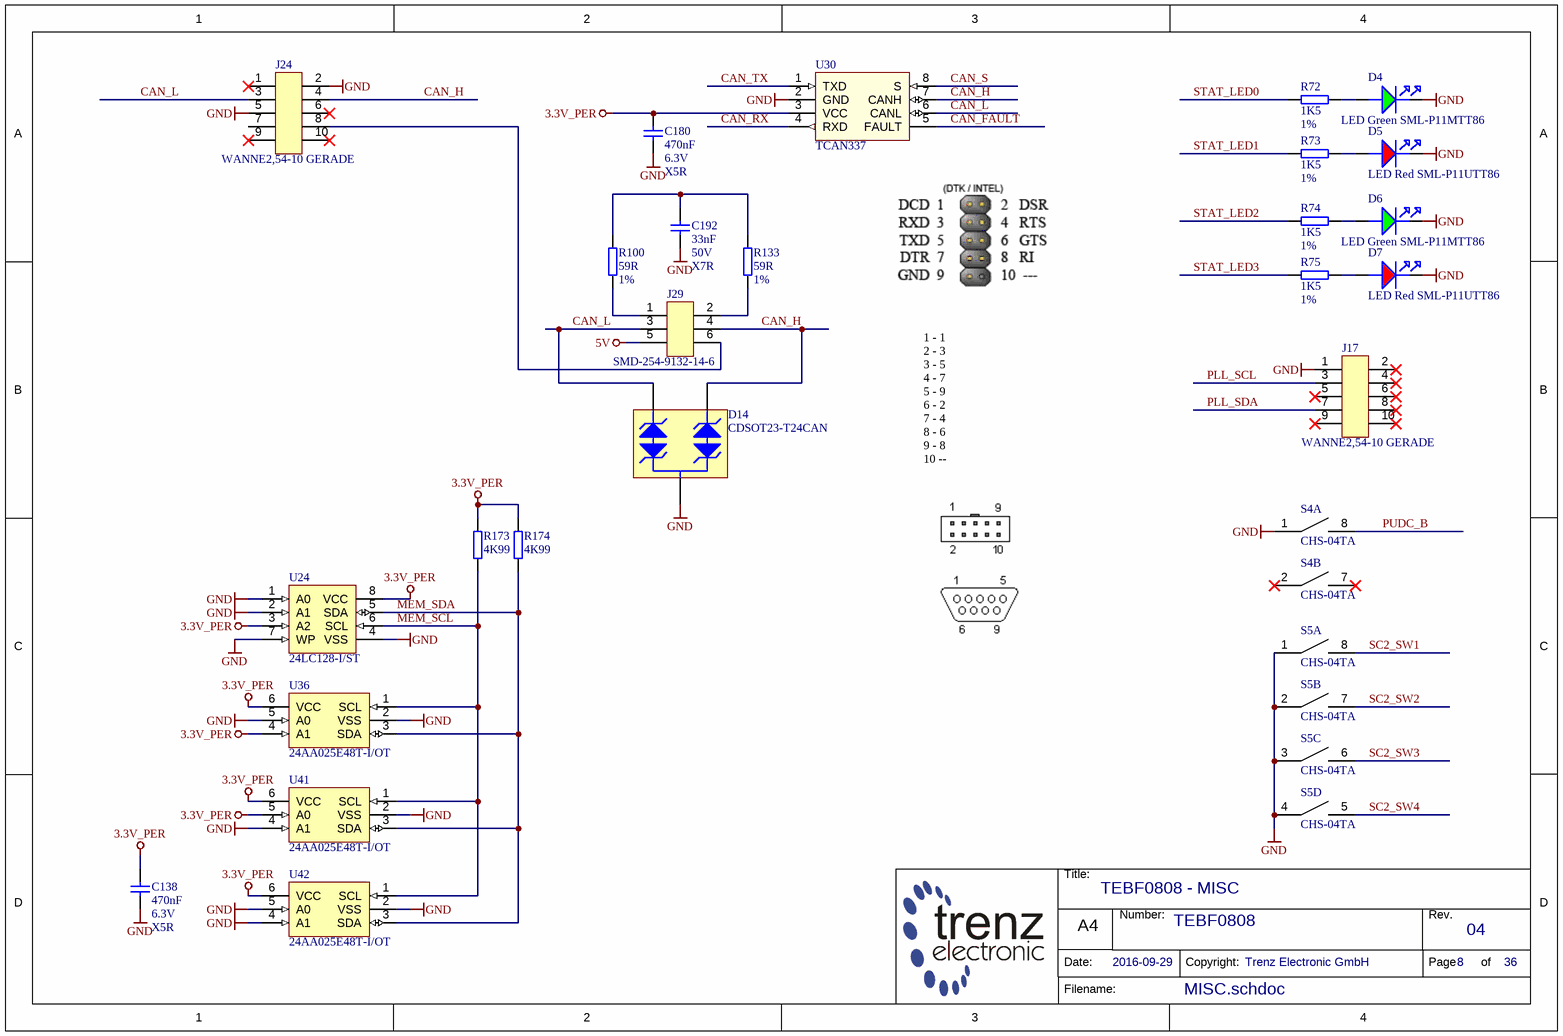
[diagram p25: MISC.schdoc]

### Parts
C138  470nF  Voltage: 6.3V  Technology: X5R  [CAPC1005X55N]
C180  470nF  Voltage: 6.3V  Technology: X5R  [CAPC1005X55N]
C192  33nF  Voltage: 50V  Technology: X7R  [CAPC1608X90N]
D4  LED Green SML-P11MTT86  [LEDC1006X25N_GREEN]
D5  LED Red SML-P11UTT86  [LEDC1006X25N_RED]
D6  LED Green SML-P11MTT86  [LEDC1006X25N_GREEN]
D7  LED Red SML-P11UTT86  [LEDC1006X25N_RED]
D14  CDSOT23-T24CAN  [SOT95P237X112-3N]
J17  WANNE2,54-10 GERADE  [WANNE2,54-10 GERADE]
J24  WANNE2,54-10 GERADE  [WANNE2,54-10 GERADE]
J29  SMD-254-9132-14-6  [SMD-254-9132-14-6]
R72  1K5  Tolerance: 1%  [RESC1005X40N]
R73  1K5  Tolerance: 1%  [RESC1005X40N]
R74  1K5  Tolerance: 1%  [RESC1005X40N]
R75  1K5  Tolerance: 1%  [RESC1005X40N]
R100  59R  Tolerance: 1%  [RESC6332X80N]
R133  59R  Tolerance: 1%  [RESC6332X80N]
R173  4K99  [RESC1005X40N]
R174  4K99  [RESC1005X40N]
S4  CHS-04TA  [CHS-04TA]  (parts A,B of 4)
S5  CHS-04TA  [CHS-04TA]  (parts A,B,C,D of 4)
U24  24LC128-I/ST  [SOP65P640X120-8N-MC]
U30  TCAN337  [SOIC127P600X175-8N]
U36  24AA025E48T-I/OT  [SOT95P280X145-6N]
U41  24AA025E48T-I/OT  [SOT95P280X145-6N]
U42  24AA025E48T-I/OT  [SOT95P280X145-6N]

### Nets
3.3V_PER: C138.1 C180.2 R173.1 R174.1 U24.3(A2) U24.8(VCC) U30.3(VCC) U36.4(A1) U36.6(VCC) U41.5(A0) U41.6(VCC) U42.6(VCC)
5V: J29.5
GND: C138.2 C180.1 C192.1 D4.K D5.K D6.K D7.K D14.3(GND) J17.1 J24.2 J24.5 S4.1 S5.1 S5.2 S5.3 S5.4 U24.1(A0) U24.2(A1) U24.4(VSS) U24.7(WP) U30.2(GND) U36.2(VSS) U36.5(A0) U41.2(VSS) U41.4(A1) U42.2(VSS) U42.4(A1) U42.5(A0)
CAN_FAULT: U30.5(FAULT)
CAN_H: D14.1(IO1) J24.4 J29.4 U30.7(CANH)
CAN_L: D14.2(IO2) J24.3 J29.3 U30.6(CANL)
CAN_RX: U30.4(RXD)
CAN_S: U30.8(S)
CAN_TX: U30.1(TXD)
MEM_SCL: R173.2 U24.6(SCL) U36.1(SCL) U41.1(SCL) U42.1(SCL)
MEM_SDA: R174.2 U24.5(SDA) U36.3(SDA) U41.3(SDA) U42.3(SDA)
PLL_SCL: J17.3
PLL_SDA: J17.7
PUDC_B: S4.8
SC2_SW1: S5.8
SC2_SW2: S5.7
SC2_SW3: S5.6
SC2_SW4: S5.5
STAT_LED0: R72.1
STAT_LED1: R73.1
STAT_LED2: R74.1
STAT_LED3: R75.1
NetC192_2: C192.2 R100.1 R133.1
NetD4_A: D4.A R72.2
NetD5_A: D5.A R73.2
NetD6_A: D6.A R74.2
NetD7_A: D7.A R75.2
NetJ24_8: J24.8 J29.6
NetJ29_1: J29.1 R100.2
NetJ29_2: J29.2 R133.2

Not connected (* = marked no-connect by the designer): J17 2* 4* 5* 6* 8* 9* 10*; J24 1* 6* 7 9* 10*; S4 2* 7*

### Notes on the sheet
- 1 - 1
  2 - 3
  3 - 5
  4 - 7
  5 - 9
  6 - 2
  7 - 4
  8 - 6
  9 - 8
  10 --
- Title:
- Number:
- Rev.
- Date:
- A4
- Copyright:
- Page
- of
- Filename:

### Library data of the parts
C138 C180 = 23659: KON 470nF 6,3V X5R SMD; AN: 23659; Mixed: SMT; Value: 470n; Preferred: Yes; Case: 1005 (0402)
C192 = 23923: KON 33nF 50V X7R SMD 10%; AN: 23923; Value: 33n; Mixed: SMT; Preferred: Yes; Case: 1608 (0603); Tolerance: 10%
D4 D6 = 24211: LED Grün SML-P11MTT86 SMD; AN: 24211; Mixed: SMT; Preferred: Yes; Case: 1005 (0402); HelpURL: B:\AD\adlib\datasheet\SML-P1; H-ART: SML-P11MTT86
D5 D7 = 24212: LED Rot SML-P11UTT86 SMD; AN: 24212; Mixed: SMT; Preferred: Yes; Case: 1005 (0402); HelpURL: B:\AD\adlib\datasheet\SML-P1; H-ART: SML-P11UTT86
D14 = 27400: AN: 27400; Mixed: SMT; Case: SOT23-3; HelpURL: b:\AD\adlib\datasheet\CDSOT23-T24CAN; H-ART: CDSOT23-T24CAN
J17 J24 = 20125: Stiftleiste Wanne 10polig; AN: 20125; Mixed: THT; Trenz-Stock: Yes; HelpURL: B:\AD\adlib\datasheet\137
J29 = 22742: Stiftleiste gerade 2-reihig, 6pol. SMD; AN: 22742; Mixed: SMT; Trenz-Stock: Yes; H-ART: 9132-14-06-00-0-00; HelpURL: B:\AD\adlib\datasheet\9532_9132
R72-R75 = 22602: as R171 on sheet Audio; Case: 1005 (0402); Technology: TK100
R100 R133 = 27515: WID SMD 59R 2W 1%; AN: 27515; Mixed: SMT; Value: 59; Case: 6332 (2512); Technology: TK100, 2W
R173 R174 = 22754: WID SMD 4K99 1% 0,063W; AN: 22754; Value: 4.99K; Mixed: SMT; Preferred: Yes; Case: 1005 (0402); Tolerance: 1%; Technology: TK100
S4 S5 = 23417: DIP Schalter 4 fach 1,27mm SMD; AN: 23417; Mixed: SMT; Trenz-Stock: Yes; HelpURL: B:\AD\adlib\datasheet\CHS; Preferred: Yes; H-ART: CHS-04TA
U24 = 22933: AN: 22933; Mixed: SMT; Trenz-Stock: Yes; Case: TSSOP8; HelpURL: B:\AD\adlib\datasheet\24LC128; Preferred: Yes; H-ART: 24LC128-I/ST
U30 = 27518: TCAN337GDR  CAN Transceivers; AN: 27518; Mixed: SMT; Case: SO8; HelpURL: b:\AD\adlib\datasheet\TCAN33x\; H-ART: TCAN337GDR
U36 U41 U42 = 26249: AN: 26249; Mixed: SMT; Case: SOT23-6; HelpURL: B:\AD\adlib\datasheet\24AA02xExx; H-ART: 24AA025E48T-I/OT

## Sheet eMMC.SchDoc: TEBF0808 - eMMC
size A4; Organization: Trenz Electronic GmbH; DocumentNumber: TEBF0808; Revision: 04; SheetNumber: 25; SheetTotal: 36; Date: 2016-09-29; CompanyName: Trenz Electronic GmbH
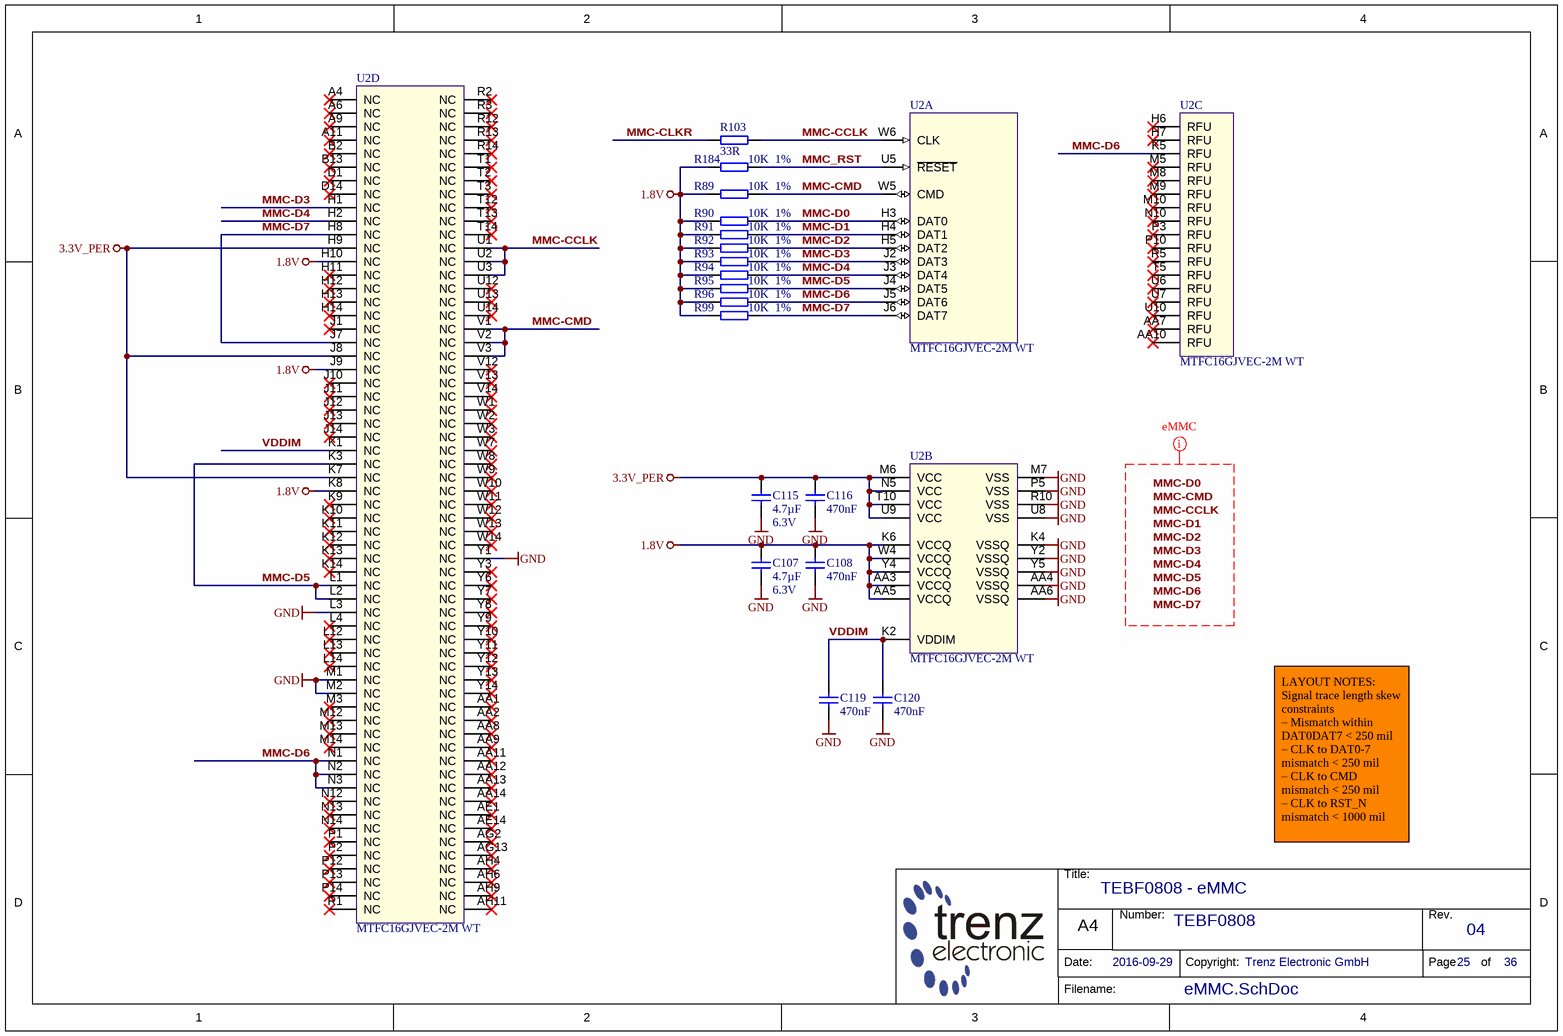
[diagram p26: eMMC.SchDoc]

### Parts
C107  4.7µF  Voltage: 6.3V  [CAPC1005X60N]
C108  470nF  [CAPC1005X55N]
C115  4.7µF  Voltage: 6.3V  [CAPC1005X60N]
C116  470nF  [CAPC1005X55N]
C119  470nF  [CAPC1005X55N]
C120  470nF  [CAPC1005X55N]
R89  10K  Tolerance: 1%  [RESC1005X40N]
R90  10K  Tolerance: 1%  [RESC1005X40N]
R91  10K  Tolerance: 1%  [RESC1005X40N]
R92  10K  Tolerance: 1%  [RESC1005X40N]
R93  10K  Tolerance: 1%  [RESC1005X40N]
R94  10K  Tolerance: 1%  [RESC1005X40N]
R95  10K  Tolerance: 1%  [RESC1005X40N]
R96  10K  Tolerance: 1%  [RESC1005X40N]
R99  10K  Tolerance: 1%  [RESC1005X40N]
R103  33R  [RESC1005X40N]
R184  10K  Tolerance: 1%  [RESC1005X40N]
U2  MTFC16GJVEC-2M WT  [BGA169C50P14X28_1400X1800X80_MICRON]  (parts A,B,C,D of 4)

### Nets
1.8V: C107.1 C108.1 R89.1 R90.1 R91.1 R92.1 R93.1 R94.1 R95.1 R96.1 R99.1 R184.1 U2.AA3(VCCQ) U2.AA5(VCCQ) U2.H10(NC) U2.J9(NC) U2.K6(VCCQ) U2.K8(NC) U2.W4(VCCQ) U2.Y4(VCCQ)
3.3V_PER: C115.1 C116.1 U2.H9(NC) U2.J8(NC) U2.K7(NC) U2.M6(VCC) U2.N5(VCC) U2.T10(VCC) U2.U9(VCC)
GND: C107.2 C108.2 C115.2 C116.2 C119.2 C120.2 U2.AA4(VSSQ) U2.AA6(VSSQ) U2.K4(VSSQ) U2.L3(NC) U2.M1(NC) U2.M2(NC) U2.M7(VSS) U2.P5(VSS) U2.R10(VSS) U2.U8(VSS) U2.Y1(NC) U2.Y2(VSSQ) U2.Y5(VSSQ)
MMC-CCLK: R103.2 U2.U1(NC) U2.U2(NC) U2.U3(NC) U2.W6(CLK)
MMC-CLKR: R103.1
MMC-CMD: R89.2 U2.V1(NC) U2.V2(NC) U2.V3(NC) U2.W5(CMD)
MMC-D0: R90.2 U2.H3(DAT0)
MMC-D1: R91.2 U2.H4(DAT1)
MMC-D2: R92.2 U2.H5(DAT2)
MMC-D3: R93.2 U2.H1(NC) U2.J2(DAT3)
MMC-D4: R94.2 U2.H2(NC) U2.J3(DAT4)
MMC-D5: R95.2 U2.J4(DAT5) U2.K3(NC) U2.L1(NC) U2.L2(NC)
MMC-D6: R96.2 U2.J5(DAT6) U2.K5(RFU) U2.N1(NC) U2.N2(NC) U2.N3(NC)
MMC-D7: R99.2 U2.H8(NC) U2.J6(DAT7) U2.J7(NC)
MMC_RST: R184.2 U2.U5(~{RESET})
VDDIM: C119.1 C120.1 U2.K1(NC) U2.K2(VDDIM)

Not connected (* = marked no-connect by the designer): U2 A4(NC)* A6(NC)* A9(NC)* A11(NC)* AA1(NC)* AA2(NC)* AA7(RFU)* AA8(NC)* AA9(NC)* AA10(RFU)* AA11(NC)* AA12(NC)* AA13(NC)* AA14(NC)* AE1(NC)* AE14(NC)* AG2(NC)* AG13(NC)* AH4(NC)* AH6(NC)* AH9(NC)* AH11(NC)* B2(NC)* B13(NC)* D1(NC)* D14(NC)* H6(RFU)* H7(RFU)* H11(NC)* H12(NC)* H13(NC)* H14(NC)* J1(NC)* J10(NC)* J11(NC)* J12(NC)* J13(NC)* J14(NC)* K9(NC)* K10(NC)* K11(NC)* K12(NC)* K13(NC)* K14(NC)* L4(NC)* L12(NC)* L13(NC)* L14(NC)* M3(NC)* M5(RFU)* M8(RFU)* M9(RFU)* M10(RFU)* M12(NC)* M13(NC)* M14(NC)* N10(RFU)* N12(NC)* N13(NC)* N14(NC)* P1(NC)* P2(NC)* P3(RFU)* P10(RFU)* P12(NC)* P13(NC)* P14(NC)* R1(NC)* R2(NC)* R3(NC)* R5(RFU)* R12(NC)* R13(NC)* R14(NC)* T1(NC)* T2(NC)* T3(NC)* T5(RFU)* T12(NC)* T13(NC)* T14(NC)* U6(RFU)* U7(RFU)* U10(RFU)* U12(NC)* U13(NC)* U14(NC)* V12(NC)* V13(NC)* V14(NC)* W1(NC)* W2(NC)* W3(NC)* W7(NC)* W8(NC)* W9(NC)* W10(NC)* W11(NC)* W12(NC)* W13(NC)* W14(NC)* Y3(NC)* Y6(NC)* Y7(NC)* Y8(NC)* Y9(NC)* Y10(NC)* Y11(NC)* Y12(NC)* Y13(NC)* Y14(NC)*

### Layout directives
net class eMMC: MMC-CCLK, MMC-CMD, MMC-D0, MMC-D1, MMC-D2, MMC-D3, MMC-D4, MMC-D5, MMC-D6, MMC-D7

### Notes on the sheet
- LAYOUT NOTES:
  Signal trace length skew constraints
  – Mismatch within DAT0DAT7 < 250 mil
  – CLK to DAT0-7 mismatch < 250 mil
  – CLK to CMD mismatch < 250 mil
  – CLK to RST_N mismatch < 1000 mil
- Labels drawn without touching a wire or pin: MMC-CCLK, MMC-CMD, MMC-D0, MMC-D1, MMC-D2, MMC-D3, MMC-D4, MMC-D5, MMC-D6, MMC-D7
- Title:
- Number:
- Rev.
- Date:
- A4
- Copyright:
- Page
- of
- Filename:

### Library data of the parts
C107 C115 = 24719: KON 4.7µF 6.3V X5R SMD 20%; AN: 24719; Value: 4.7u; Mixed: SMT; Preferred: Yes; Case: 1005 (0402); Technology: X5R; Tolerance: 20%
C108 C116 C119 C120 = 23659: KON 470nF 6,3V X5R SMD; AN: 23659; Value: 470n; Voltage: 6.3V; Mixed: SMT; Preferred: Yes; Case: 1005 (0402); Technology: X5R
R89-R96 R99 R184 = 22750: as R6 on sheet Audio; Case: 1005 (0402); Value: 10K; Technology: TK100
R103 = 22770: as R128 on sheet Audio; Tolerance: 1%; Case: 1005 (0402); Technology: TK100
U2 = 25015: AN: 25015; Trenz-Stock: Yes; Mixed: SMT; Case: WFBGA169; HelpURL: B:\AD\adlib\datasheet\MTFC; H-ART: MTFC16GJVEC-2M WT

## Sheet FireFly.SchDoc: TEBF0808 - FireFly
size A4; PageSetup: Record=PageOptions|CenterHorizontal=True|CenterVertical=True|PrintScale=0.96|XCorrection=1.00|YCorrection=1.00|PrintKind=0|BorderSize=5000000|LeftOffset=0|BottomOffset=0|Orientation=2|PaperLength=1000|PaperWidth=1000|Scale=100|PaperSource=7|PrintQuality=-4|MediaType=1|DitherType=10|PaperKind=A4|PrintScaleMode=1; Organization: Trenz Electronic GmbH; DocumentNumber: TEBF0808; Revision: 04; SheetNumber: 28; SheetTotal: 36; Date: 2016-09-29; CompanyName: Trenz Electronic GmbH
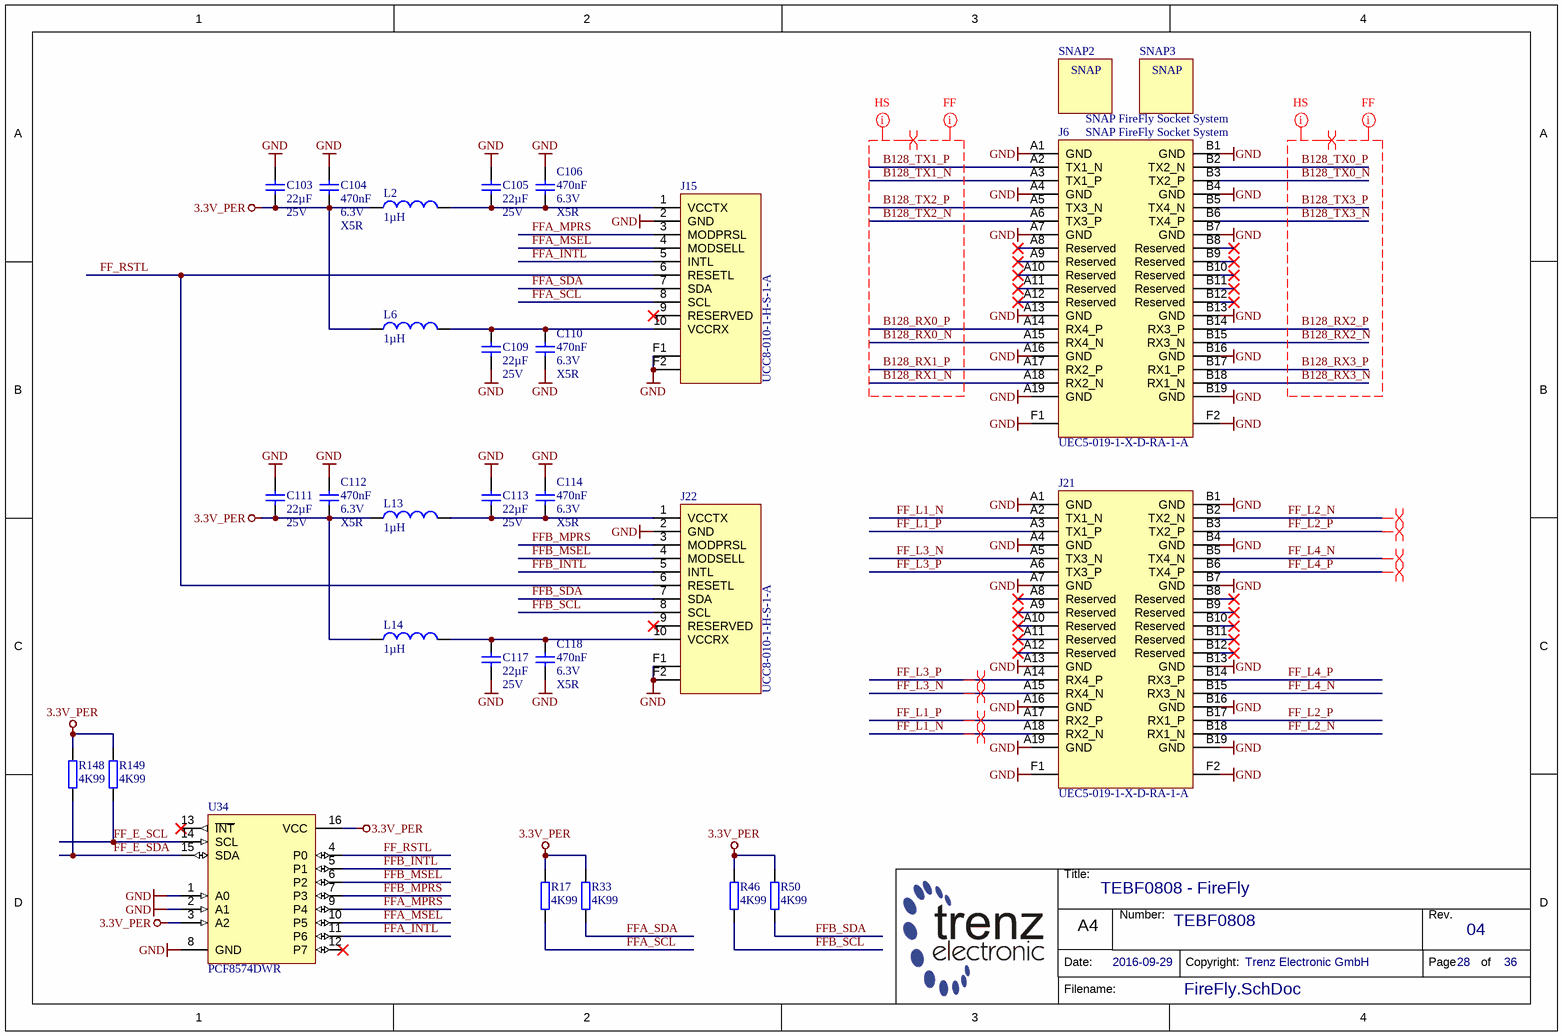
[diagram p27: FireFly.SchDoc]

### Parts
C103  22µF  Voltage: 25V  [CAPC3216X180N]
C104  470nF  Voltage: 6.3V  Technology: X5R  [CAPC1005X55N]
C105  22µF  Voltage: 25V  [CAPC3216X180N]
C106  470nF  Voltage: 6.3V  Technology: X5R  [CAPC1005X55N]
C109  22µF  Voltage: 25V  [CAPC3216X180N]
C110  470nF  Voltage: 6.3V  Technology: X5R  [CAPC1005X55N]
C111  22µF  Voltage: 25V  [CAPC3216X180N]
C112  470nF  Voltage: 6.3V  Technology: X5R  [CAPC1005X55N]
C113  22µF  Voltage: 25V  [CAPC3216X180N]
C114  470nF  Voltage: 6.3V  Technology: X5R  [CAPC1005X55N]
C117  22µF  Voltage: 25V  [CAPC3216X180N]
C118  470nF  Voltage: 6.3V  Technology: X5R  [CAPC1005X55N]
J6  UEC5-019-1-X-D-RA-1-A  [UEC5-019-1-X-D-RA-1-A]
J15  UCC8-010-1-H-S-1-A  [UCC8-010-1-X-S-1-A]
J21  UEC5-019-1-X-D-RA-1-A  [UEC5-019-1-X-D-RA-1-A]
J22  UCC8-010-1-H-S-1-A  [UCC8-010-1-X-S-1-A]
L2  1µH  [INDC2520X100N]
L6  1µH  [INDC2520X100N]
L13  1µH  [INDC2520X100N]
L14  1µH  [INDC2520X100N]
R17  4K99  [RESC1005X40N]
R33  4K99  [RESC1005X40N]
R46  4K99  [RESC1005X40N]
R50  4K99  [RESC1005X40N]
R148  4K99  [RESC1005X40N]
R149  4K99  [RESC1005X40N]
SNAP2  SNAP FireFly Socket System  [FireFly_Snap]  (no BOM)
SNAP3  SNAP FireFly Socket System  [FireFly_Snap]  (no BOM)
U34  PCF8574DWR  [SOIC127P1030X265-16N]

### Nets
3.3V_PER: C103.2 C104.2 C111.2 C112.2 L2.1 L6.1 L13.1 L14.1 R17.1 R33.1 R46.1 R50.1 R148.1 R149.1 U34.3(A2) U34.16(VCC)
GND: C103.1 C104.1 C105.2 C106.1 C109.1 C110.2 C111.1 C112.1 C113.2 C114.1 C117.1 C118.2 J6.A1(GND) J6.A4(GND) J6.A7(GND) J6.A13(GND) J6.A16(GND) J6.A19(GND) J6.B1(GND) J6.B4(GND) J6.B7(GND) J6.B13(GND) J6.B16(GND) J6.B19(GND) J6.F1(GND) J6.F2(GND) J15.2(GND) J15.F1(GND) J15.F2(GND) J21.A1(GND) J21.A4(GND) J21.A7(GND) J21.A13(GND) J21.A16(GND) J21.A19(GND) J21.B1(GND) J21.B4(GND) J21.B7(GND) J21.B13(GND) J21.B16(GND) J21.B19(GND) J21.F1(GND) J21.F2(GND) J22.2(GND) J22.F1(GND) J22.F2(GND) U34.1(A0) U34.2(A1) U34.8(GND)
B128_RX0_N: J6.A15(RX4_N)
B128_RX0_P: J6.A14(RX4_P)
B128_RX1_N: J6.A18(RX2_N)
B128_RX1_P: J6.A17(RX2_P)
B128_RX2_N: J6.B15(RX3_N)
B128_RX2_P: J6.B14(RX3_P)
B128_RX3_N: J6.B18(RX1_N)
B128_RX3_P: J6.B17(RX1_P)
B128_TX0_N: J6.B3(TX2_P)
B128_TX0_P: J6.B2(TX2_N)
B128_TX1_N: J6.A3(TX1_P)
B128_TX1_P: J6.A2(TX1_N)
B128_TX2_N: J6.A6(TX3_P)
B128_TX2_P: J6.A5(TX3_N)
B128_TX3_N: J6.B6(TX4_P)
B128_TX3_P: J6.B5(TX4_N)
FF_E_SCL: R149.2 U34.14(SCL)
FF_E_SDA: R148.2 U34.15(SDA)
FF_L1_N: J21.A2(TX1_N) J21.A18(RX2_N)
FF_L1_P: J21.A3(TX1_P) J21.A17(RX2_P)
FF_L2_N: J21.B2(TX2_N) J21.B18(RX1_N)
FF_L2_P: J21.B3(TX2_P) J21.B17(RX1_P)
FF_L3_N: J21.A5(TX3_N) J21.A15(RX4_N)
FF_L3_P: J21.A6(TX3_P) J21.A14(RX4_P)
FF_L4_N: J21.B5(TX4_N) J21.B15(RX3_N)
FF_L4_P: J21.B6(TX4_P) J21.B14(RX3_P)
FF_RSTL: J15.6(RESETL) J22.6(RESETL) U34.4(P0)
FFA_INTL: J15.5(INTL) U34.11(P6)
FFA_MPRS: J15.3(MODPRSL) U34.9(P4)
FFA_MSEL: J15.4(MODSELL) U34.10(P5)
FFA_SCL: J15.8(SCL) R17.2
FFA_SDA: J15.7(SDA) R33.2
FFB_INTL: J22.5(INTL) U34.5(P1)
FFB_MPRS: J22.3(MODPRSL) U34.7(P3)
FFB_MSEL: J22.4(MODSELL) U34.6(P2)
FFB_SCL: J22.8(SCL) R46.2
FFB_SDA: J22.7(SDA) R50.2
NetC105_1: C105.1 C106.2 J15.1(VCCTX) L2.2
NetC109_2: C109.2 C110.1 J15.10(VCCRX) L6.2
NetC113_1: C113.1 C114.2 J22.1(VCCTX) L13.2
NetC117_2: C117.2 C118.1 J22.10(VCCRX) L14.2

Not connected (* = marked no-connect by the designer): J6 A8(Reserved)* A9(Reserved)* A10(Reserved)* A11(Reserved)* A12(Reserved)* B8(Reserved)* B9(Reserved)* B10(Reserved)* B11(Reserved)* B12(Reserved)*; J15 9(RESERVED)*; J21 A8(Reserved)* A9(Reserved)* A10(Reserved)* A11(Reserved)* A12(Reserved)* B8(Reserved)* B9(Reserved)* B10(Reserved)* B11(Reserved)* B12(Reserved)*; J22 9(RESERVED)*; U34 12(P7)* 13(~{INT})*

### Layout directives
differential pair: B128_RX0_N, B128_RX0_P, B128_RX1_N, B128_RX1_P, B128_RX2_N, B128_RX2_P, B128_RX3_N, B128_RX3_P, B128_TX0_N, B128_TX0_P, B128_TX1_N, B128_TX1_P, B128_TX2_N, B128_TX2_P, B128_TX3_N, B128_TX3_P, FF_L1_N, FF_L1_P, FF_L2_N, FF_L2_P, FF_L3_N, FF_L3_P, FF_L4_N, FF_L4_P
net class HS: B128_RX0_N, B128_RX0_P, B128_RX1_N, B128_RX1_P, B128_RX2_N, B128_RX2_P, B128_RX3_N, B128_RX3_P, B128_TX0_N, B128_TX0_P, B128_TX1_N, B128_TX1_P, B128_TX2_N, B128_TX2_P, B128_TX3_N, B128_TX3_P
net class FF: B128_RX0_N, B128_RX0_P, B128_RX1_N, B128_RX1_P, B128_RX2_N, B128_RX2_P, B128_RX3_N, B128_RX3_P, B128_TX0_N, B128_TX0_P, B128_TX1_N, B128_TX1_P, B128_TX2_N, B128_TX2_P, B128_TX3_N, B128_TX3_P

### Notes on the sheet
- Title:
- Number:
- Rev.
- Date:
- A4
- Copyright:
- Page
- of
- Filename:
- (in symbol 27358) SNAP

### Library data of the parts
C103 C105 C109 C111 C113 C117 = 24886: KON 22µF X5R 25V SMD 10%; AN: 24886; Value: 22u; Mixed: SMT; Preferred: Yes; Case: 3216 (1206); Tolerance: 10%
C104 C106 C110 C112 C114 C118 = 23659: as C19 on sheet Audio; Case: 1005 (0402)
J6 J21 = 27355: UEC5-019-1-H-D-RA-1-A; AN: 27355; Mixed: SMT; Case: UEC5; HelpURL: B:\AD\adlib\datasheet\UEC5_UCC8; H-ART: UEC5-019-1-H-D-RA-1-A
J15 J22 = 27354: AN: 27354; Mixed: SMT; Case: UCC8; HelpURL: B:\AD\adlib\datasheet\UEC5_UCC8; H-ART: UCC8-010-1-H-S-1-A
L2 L6 L13 L14 = 25265: IND SMD 1µH +-20% 0.055Ohm; AN: 25265; Value: 1u; Trenz-Stock: Yes; Voltage: 1.7A; Mixed: SMT; H-ART: 74479787210a; Case: WE-PMI 2520(1008); HelpURL: B:\AD\adlib\datasheet\74479787210a; Technology: 0.055Ohm
R17 R33 R46 R50 R148 R149 = 22754: as R173 on sheet MISC; Case: 1005 (0402); Tolerance: 1%; Technology: TK100
SNAP2 SNAP3 = 27358: AN: 27358; Mixed: SMT
U34 = 26502: AN: 26502; Mixed: SMT; Case: SO16W DW; HelpURL: B:\AD\adlib\datasheet\PCF8574; H-ART: PCF8574DWR

## Sheet Power_3.schdoc: TEBF0808 - Power
size A4; DocumentNumber: TEBF0808; Revision: 04; SheetNumber: 33; SheetTotal: 36; Date: 2016-09-29; CompanyName: Trenz Electronic GmbH; Organization: Trenz Electronic GmbH
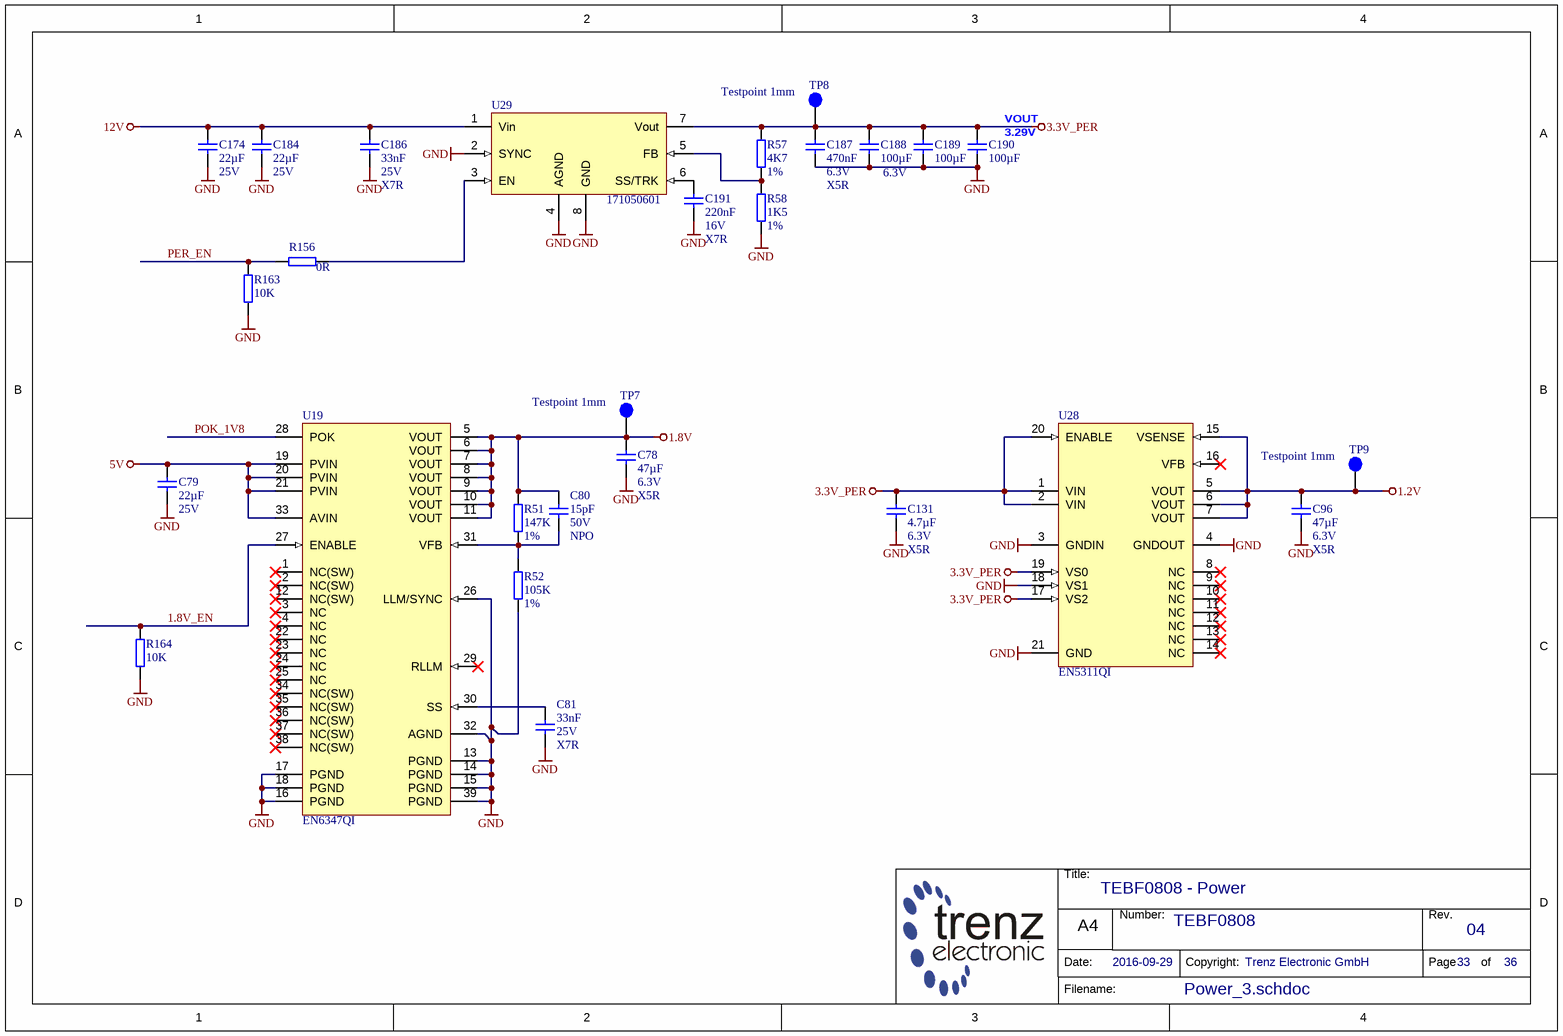
[diagram p28: Power_3.schdoc]

### Parts
C78  47µF  Voltage: 6.3V  Technology: X5R  [CAPC3216X180N]
C79  22µF  Voltage: 25V  [CAPC3216X180N]
C80  15pF  Voltage: 50V  Technology: NPO  [CAPC1005X55N]
C81  33nF  Voltage: 25V  Technology: X7R  [CAPC1005X55N]
C96  47µF  Voltage: 6.3V  Technology: X5R  [CAPC3216X180N]
C131  4.7µF  Voltage: 6.3V  Technology: X5R  [CAPC1005X60N]
C174  22µF  Voltage: 25V  [CAPC3216X180N]
C184  22µF  Voltage: 25V  [CAPC3216X180N]
C186  33nF  Voltage: 25V  Technology: X7R  [CAPC1005X55N]
C187  470nF  Voltage: 6.3V  Technology: X5R  [CAPC1005X55N]
C188  100µF  Voltage: 6.3V  [CAPC3216X180N]
C189  100µF  [CAPC3216X180N]
C190  100µF  [CAPC3216X180N]
C191  220nF  Voltage: 16V  Technology: X7R  [CAPC1005X55N]
R51  147K  Tolerance: 1%  [RESC1005X40N]
R52  105K  Tolerance: 1%  [RESC1005X40N]
R57  4K7  Tolerance: 1%  [RESC1005X40N]
R58  1K5  Tolerance: 1%  [RESC1005X40N]
R156  0R  [RESC1005X40N]
R163  10K  [RESC1005X40N]
R164  10K  [RESC1005X40N]
TP7  Testpoint 1mm  [TP_1mm]
TP8  Testpoint 1mm  [TP_1mm]
TP9  Testpoint 1mm  [TP_1mm]
U19  EN6347QI  [EN63xx]
U28  EN5311QI  [EN5311QI]
U29  171050601  [7TO-PMOD]

### Nets
1.2V: C96.1 TP9.1 U28.5(VOUT) U28.6(VOUT) U28.7(VOUT) U28.15(VSENSE)
1.8V: C78.1 C80.1 R51.2 TP7.1 U19.5(VOUT) U19.6(VOUT) U19.7(VOUT) U19.8(VOUT) U19.9(VOUT) U19.10(VOUT) U19.11(VOUT)
3.3V_PER: C131.1 C187.1 C188.1 C189.1 C190.1 R57.1 TP8.1 U28.1(VIN) U28.2(VIN) U28.17(VS2) U28.19(VS0) U28.20(ENABLE) U29.7(Vout)
5V: C79.2 U19.19(PVIN) U19.20(PVIN) U19.21(PVIN) U19.33(AVIN)
12V: C174.2 C184.2 C186.1 U29.1(Vin)
GND: C78.2 C79.1 C81.2 C96.2 C131.2 C174.1 C184.1 C186.2 C187.2 C188.2 C189.2 C190.2 C191.2 R52.2 R58.2 R163.1 R164.1 U19.13(PGND) U19.14(PGND) U19.15(PGND) U19.16(PGND) U19.17(PGND) U19.18(PGND) U19.26(LLM/SYNC) U19.32(AGND) U19.39(PGND) U28.3(GNDIN) U28.4(GNDOUT) U28.18(VS1) U28.21(GND) U29.2(SYNC) U29.4(AGND) U29.8(GND)
1.8V_EN: R164.2 U19.27(ENABLE)
PER_EN: R156.2 R163.2
POK_1V8: U19.28(POK)
NetC80_2: C80.2 R51.1 R52.1 U19.31(VFB)
NetC81_1: C81.1 U19.30(SS)
NetC191_1: C191.1 U29.6(SS/TRK)
NetR57_2: R57.2 R58.1 U29.5(FB)
NetR156_1: R156.1 U29.3(EN)

Not connected (* = marked no-connect by the designer): U19 1(NC(SW))* 2(NC(SW))* 3(NC)* 4(NC)* 12(NC(SW))* 22(NC)* 23(NC)* 24(NC)* 25(NC)* 29(RLLM)* 34(NC(SW))* 35(NC(SW))* 36(NC(SW))* 37(NC(SW))* 38(NC(SW))*; U28 8(NC)* 9(NC)* 10(NC)* 11(NC)* 12(NC)* 13(NC)* 14(NC)* 16(VFB)*

### Notes on the sheet
- (near C190) VOUT
- (near C190) 3.29V
- Title:
- Number:
- Rev.
- Date:
- A4
- Copyright:
- Page
- of
- Filename:

### Library data of the parts
C78 C96 = 24557: KON 47µF 6.3V  X5R SMD 20%; AN: 24557; Value: 47u; Mixed: SMT; Preferred: Yes; Case: 3216 (1206); Tolerance: 20%
C79 C174 C184 = 24886: as C103 on sheet FireFly; Case: 3216 (1206); Tolerance: 10%
C80 = 23951: KON 15pF NPO 50V SMD; AN: 23951; Value: 15p; Mixed: SMT; Preferred: Yes; Case: 1005 (0402)
C81 C186 = 23916: KON 33nF 25V X7R SMD; AN: 23916; Value: 33n; Mixed: SMT; Preferred: Yes; Case: 1005 (0402)
C131 = 24719: as C207 on sheet Audio; Case: 1005 (0402); Tolerance: 20%
C187 = 23659: as C138 on sheet MISC; Case: 1005 (0402)
C188 = 23116: as C55 on sheet Audio; Case: 3216 (1206); Tolerance: 20%; Technology: X5R
C189 C190 = 23116: KON 100µF 6,3V X5R SMD 20%; AN: 23116; Mixed: SMT; Value: 100u; Preferred: Yes; Voltage: 6.3V; Case: 3216 (1206); Tolerance: 20%; Technology: X5R
C191 = 22768: KON 220nF 16V X7R SMD; AN: 22768; Mixed: SMT; Value: 220n; Case: 1005 (0402)
R51 = 26470: WID SMD 147K 1% 0,063W; AN: 26470; Mixed: SMT; Preferred: Yes; Case: 1005 (0402); Technology: TK100; Value: 147K
R52 = 26467: WID SMD 105K 1% 0,063W; AN: 26467; Mixed: SMT; Preferred: Yes; Case: 1005 (0402); Technology: TK100; Value: 105K
R57 = 22585: as R170 on sheet Audio; Case: 1005 (0402); Technology: TK100
R58 = 22602: as R171 on sheet Audio; Case: 1005 (0402); Technology: TK100
R156 = 22738: as R20 on sheet Audio; Case: 1005 (0402); Technology: TK100
R163 R164 = 22750: as R6 on sheet Audio; Case: 1005 (0402); Value: 10K; Tolerance: 1%; Technology: TK100
TP7-TP9 = 25063: AN: 25063; Mixed: SMT
U19 = 24486: AN: 24486; Trenz-Stock: Yes; Mixed: SMT; HelpURL: B:\AD\adlib\datasheet\EN6347QI; Preferred: Yes; H-ART: EN6347QI
U28 = 25492: AN: 25492; Mixed: SMT; Trenz-Stock: Yes; Case: QFN20; HelpURL: B:\AD\adlib\datasheet\EN5311QI; Preferred: Yes; H-ART: EN5311QI
U29 = 26051: AN: 26051; Mixed: SMT; Case: TO263-7EP; HelpURL: B:\AD\adlib\datasheet\171050601; H-ART: 171050601

## Sheet Power_4.schdoc: TEBF0808 - Power
size A4; DocumentNumber: TEBF0808; Revision: 04; SheetNumber: 34; SheetTotal: 36; Date: 2016-09-29; CompanyName: Trenz Electronic GmbH; Organization: Trenz Electronic GmbH
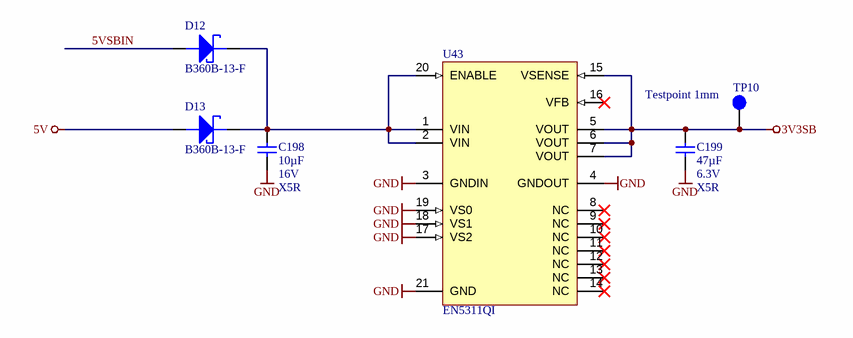
[diagram p29: Power_4.schdoc]

### Parts
C198  10µF  Voltage: 16V  Technology: X5R  [CAPC1608X90N]
C199  47µF  Voltage: 6.3V  Technology: X5R  [CAPC3216X180N]
D12  B360B-13-F  [DIOM4336X250N]
D13  B360B-13-F  [DIOM4336X250N]
TP10  Testpoint 1mm  [TP_1mm]
U43  EN5311QI  [EN5311QI]

### Nets
3V3SB: C199.1 TP10.1 U43.5(VOUT) U43.6(VOUT) U43.7(VOUT) U43.15(VSENSE)
5V: D13.2(ANODE)
GND: C198.2 C199.2 U43.3(GNDIN) U43.4(GNDOUT) U43.17(VS2) U43.18(VS1) U43.19(VS0) U43.21(GND)
5VSBIN: D12.2(ANODE)
NetC198_1: C198.1 D12.1(KATHODE) D13.1(KATHODE) U43.1(VIN) U43.2(VIN) U43.20(ENABLE)

Not connected (* = marked no-connect by the designer): U43 8(NC)* 9(NC)* 10(NC)* 11(NC)* 12(NC)* 13(NC)* 14(NC)* 16(VFB)*

### Notes on the sheet
- Title:
- Number:
- Rev.
- Date:
- A4
- Copyright:
- Page
- of
- Filename:

### Library data of the parts
C198 = 25341: KON 10µF 16V X5R SMD 20%; AN: 25341; Mixed: SMT; Value: 10u; Preferred: Yes; Case: 1608 (0603); Tolerance: 20%
C199 = 24557: as C78 on sheet Power_3; Case: 3216 (1206); Tolerance: 20%
D12 D13 = 24916: B360B-13-F SMD; AN: 24916; Mixed: SMT; Case: SMB; HelpURL: B:\AD\adlib\datasheet\B3x0B; H-ART: B360B-13-F
TP10 = 25063: AN: 25063; Mixed: SMT
U43 = 25492: AN: 25492; Mixed: SMT; Trenz-Stock: Yes; Case: QFN20; HelpURL: B:\AD\adlib\datasheet\EN5311QI; Preferred: Yes; H-ART: EN5311QI

## Sheet CLK_MUX.schdoc: TEBF0808 - CLK
size A4; DocumentNumber: TEBF0808; Revision: 04; SheetNumber: 23; SheetTotal: 36; Date: 2016-09-29; CompanyName: Trenz Electronic GmbH; Organization: Trenz Electronic GmbH
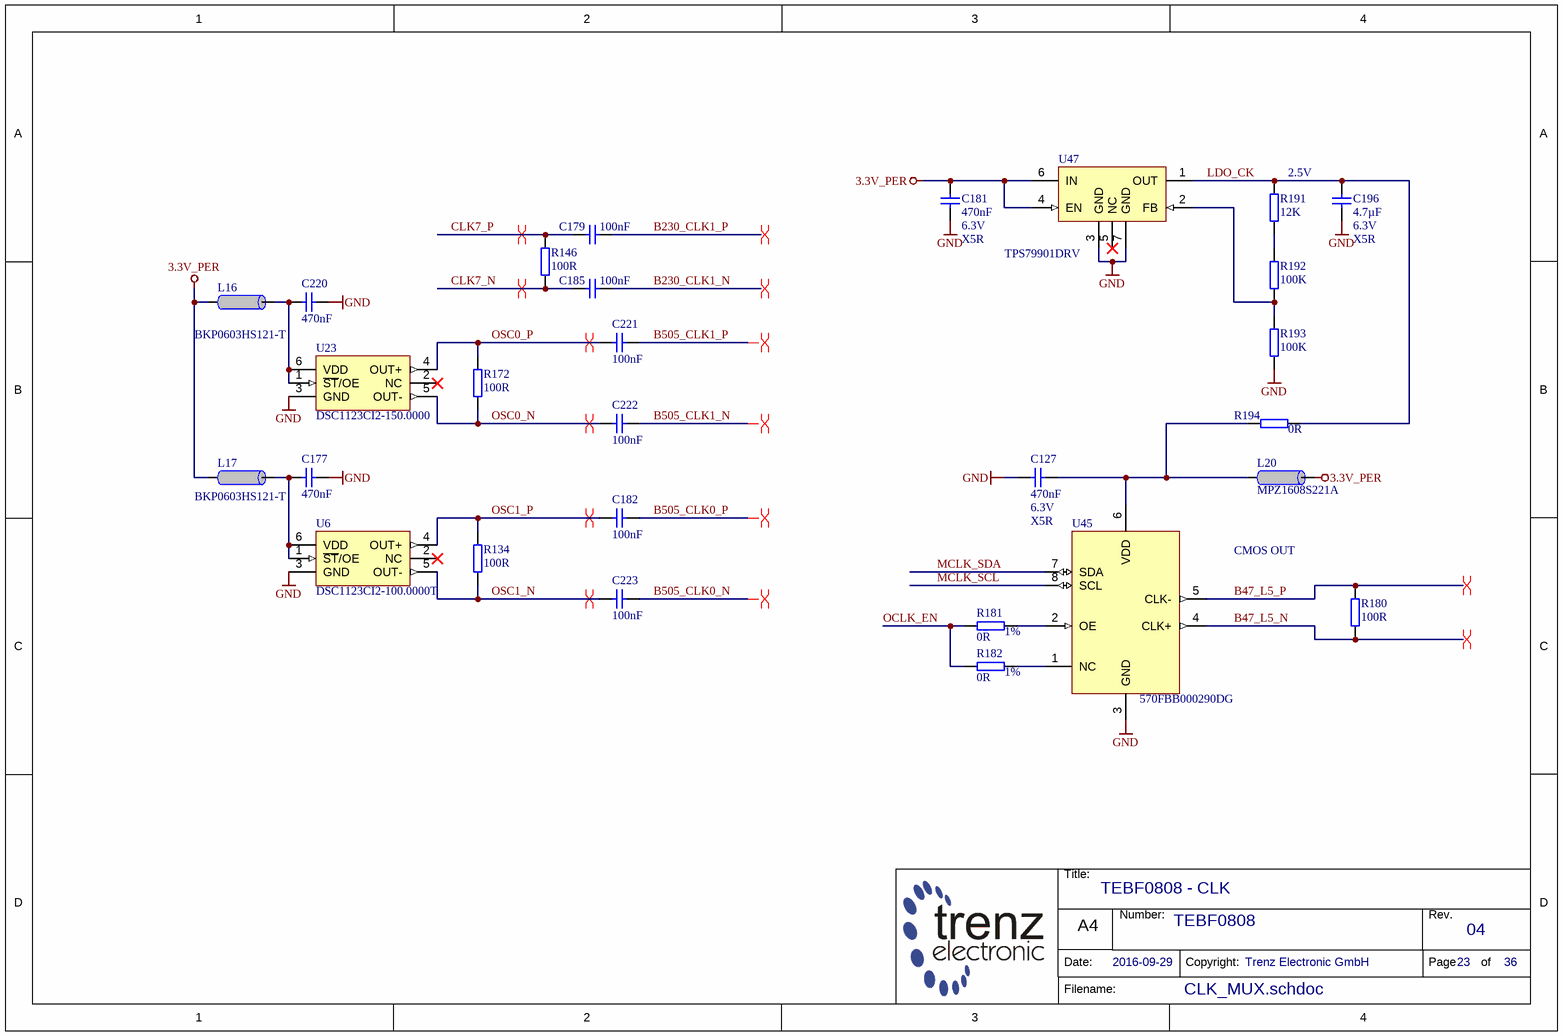
[diagram p30: CLK_MUX.schdoc]

### Parts
C127  470nF  Voltage: 6.3V  Technology: X5R  [CAPC1005X55N]
C177  470nF  [CAPC0603X33N]
C179  100nF  [CAPC0603X33N]
C181  470nF  Voltage: 6.3V  Technology: X5R  [CAPC1005X55N]
C182  100nF  [CAPC0603X33N]
C185  100nF  [CAPC0603X33N]
C196  4.7µF  Voltage: 6.3V  Technology: X5R  [CAPC1005X60N]
C220  470nF  [CAPC0603X33N]
C221  100nF  [CAPC0603X33N]
C222  100nF  [CAPC0603X33N]
C223  100nF  [CAPC0603X33N]
L16  BKP0603HS121-T  [INDC0603X33N]
L17  BKP0603HS121-T  [INDC0603X33N]
L20  MPZ1608S221A  [INDC1608X95N]
R134  100R  [RESC0603X26N]
R146  100R  [RESC1005X40N]
R172  100R  [RESC0603X26N]
R180  100R  [RESC1005X40N]
R181  0R  Tolerance: 1%  [RESC1005X40N]
R182  0R  Tolerance: 1%  [RESC1005X40N]
R191  12K  [RESC1005X40N]
R192  100K  [RESC1005X40N]
R193  100K  [RESC1005X40N]
R194  0R  [RESC1005X40N]
U6  DSC1123CI2-100.0000T  [PSON105P320X250X90-6N]
U23  DSC1123CI2-150.0000  [PSON105P320X250X90-6N]
U45  570FBB000290DG  [OSCCC500X700X180-8N]
U47  TPS79901DRV  [SON65P200X210X80-7N-TI]

### Nets
3.3V_PER: C181.2 L16.1 L17.1 L20.2 U47.4(EN) U47.6(IN)
GND: C127.1 C177.1 C181.1 C196.2 C220.1 R193.1 U6.3(GND) U23.3(GND) U45.3(GND) U47.3(GND) U47.7(GND)
B47_L5_N: R180.2 U45.4(CLK+)
B47_L5_P: R180.1 U45.5(CLK-)
B230_CLK1_N: C185.2
B230_CLK1_P: C179.2
B505_CLK0_N: C223.2
B505_CLK0_P: C182.2
B505_CLK1_N: C222.2
B505_CLK1_P: C221.2
CLK7_N: C185.1 R146.2
CLK7_P: C179.1 R146.1
LDO_CK: C196.1 R191.1 R194.1 U47.1(OUT)
MCLK_SCL: U45.8(SCL)
MCLK_SDA: U45.7(SDA)
OCLK_EN: R181.1 R182.1
OSC0_N: C222.1 R172.1 U23.5(OUT-)
OSC0_P: C221.1 R172.2 U23.4(OUT+)
OSC1_N: C223.1 R134.1 U6.5(OUT-)
OSC1_P: C182.1 R134.2 U6.4(OUT+)
NetC127_2: C127.2 L20.1 R194.2 U45.6(VDD)
NetC177_2: C177.2 L17.2 U6.1(~{ST}/OE) U6.6(VDD)
NetC220_2: C220.2 L16.2 U23.1(~{ST}/OE) U23.6(VDD)
NetR181_2: R181.2 U45.2(OE)
NetR182_2: R182.2 U45.1(NC)
NetR191_2: R191.2 R192.2
NetR192_1: R192.1 R193.2 U47.2(FB)

Not connected (* = marked no-connect by the designer): U6 2(NC)*; U23 2(NC)*; U47 5(NC)*

### Layout directives
differential pair: B47_L5_N, B47_L5_P, B230_CLK1_N, B230_CLK1_P, B505_CLK0_N, B505_CLK0_P, B505_CLK1_N, B505_CLK1_P, CLK7_N, CLK7_P, OSC0_N, OSC0_P, OSC1_N, OSC1_P

### Notes on the sheet
- 2.5V
- CMOS OUT
- Title:
- Number:
- Rev.
- Date:
- A4
- Copyright:
- Page
- of
- Filename:

### Library data of the parts
C127 C181 = 23659: as C19 on sheet Audio; Case: 1005 (0402)
C177 C220 = 24921: KON 470nF X5R 6.3V SMD 20%; AN: 24921; Mixed: SMT; Value: 470n; Preferred: Yes; Voltage: 6.3V; Technology: X5R; Case: 0603 (0201); Tolerance: 20%
C179 C182 C185 C221-C223 = 24915: as C16 on sheet Audio; Voltage: 6.3V; Technology: X5R; Case: 0603 (0201); Tolerance: 10%
C196 = 24719: as C207 on sheet Audio; Case: 1005 (0402); Tolerance: 20%
L16 L17 = 25393: Ferritdurchführung SMD 0201; AN: 25393; Mixed: SMT; Trenz-Stock: Yes; Tolerance: 25%; Case: 0603 (0201); HelpURL: B:\AD\adlib\datasheet\MULTILAYER CHIP BEAD INDUCTORS BK; Preferred: Yes; H-ART: BKP0603HS121-T
L20 = 22718: Ferritdurchführung MPZ1608S221A; AN: 22718; Mixed: SMT; Trenz-Stock: Yes; Value: 220 OHm @ 100MHz; Case: 1608 (0603); HelpURL: B:\AD\adlib\datasheet\MPZ1608; Preferred: Yes; H-ART: MPZ1608S221A
R134 R172 = 22503: WID SMD 100R 1% 0,05W; AN: 22503; Mixed: SMT; Value: 100; Preferred: Yes; Case: 0603 (0201); Tolerance: 1%; Technology: TK100
R146 R180 = 22507: as R11 on sheet Audio; Tolerance: 1%; Case: 1005 (0402); Technology: TK100
R181 R182 = 22738: WID SMD 0R; AN: 22738; Mixed: SMT; Value: 0; Preferred: Yes; Case: 1005 (0402); Technology: TK100
R191 = 22598: as R204 on sheet FMC PWR; Tolerance: 1%; Case: 1005 (0402); Technology: TK100; Value: 12K
R192 R193 = 22558: WID SMD 100K 1% 0,063W; AN: 22558; Mixed: SMT; Preferred: Yes; Tolerance: 1%; Case: 1005 (0402); Technology: TK100; Value: 100K
R194 = 22738: as R20 on sheet Audio; Case: 1005 (0402); Technology: TK100
U6 = 27516: DSC1123CI2-100.0000T 100MHz LVDS clock; AN: 27516; Tolerance: 25ppm; Mixed: SMT; Value: 100M; Case: 3.2 mm x 2.5 mm; HelpURL: B:\AD\adlib\datasheet\DSC11xx; H-ART: DSC1123CI2-100.0000T
U23 = 27517: DSC1123CI2-150.0000 150MHz LVDS clock; AN: 27517; Tolerance: 25ppm; Mixed: SMT; Value: 150M; Case: 3.2 mm x 2.5 mm; HelpURL: B:\AD\adlib\datasheet\DSC11xx; H-ART: DSC1123CI2-150.0000
U45 = 24194: Si570 , LVDS , 2.5V , 250MHz; AN: 24194; Mixed: SMT; Trenz-Stock: Yes; Ordercode: *; Partnumber: *; Rating: *; Price-1$: *; HelpURL: B:\AD\adlib\datasheet\Si570; H-ART: 570FBB000290DG
U47 = 22805: AN: 22805; Mixed: SMT; Trenz-Stock: Yes; Case: SON6; HelpURL: B:\AD\adlib\datasheet\TPS799XX; H-ART: TPS79901DRV